# EasyEDA Pro project usbc_hub.epro

# Schematic Schematic1
Board Name: Board1; Create Date: 2025-07-18; Page Name: P1; Project Name: usbchub; Schematic Name: Schematic1; Update Date: 2025-07-29; Company: EasyEDA.com; Page Size: A4; Version: V1.0
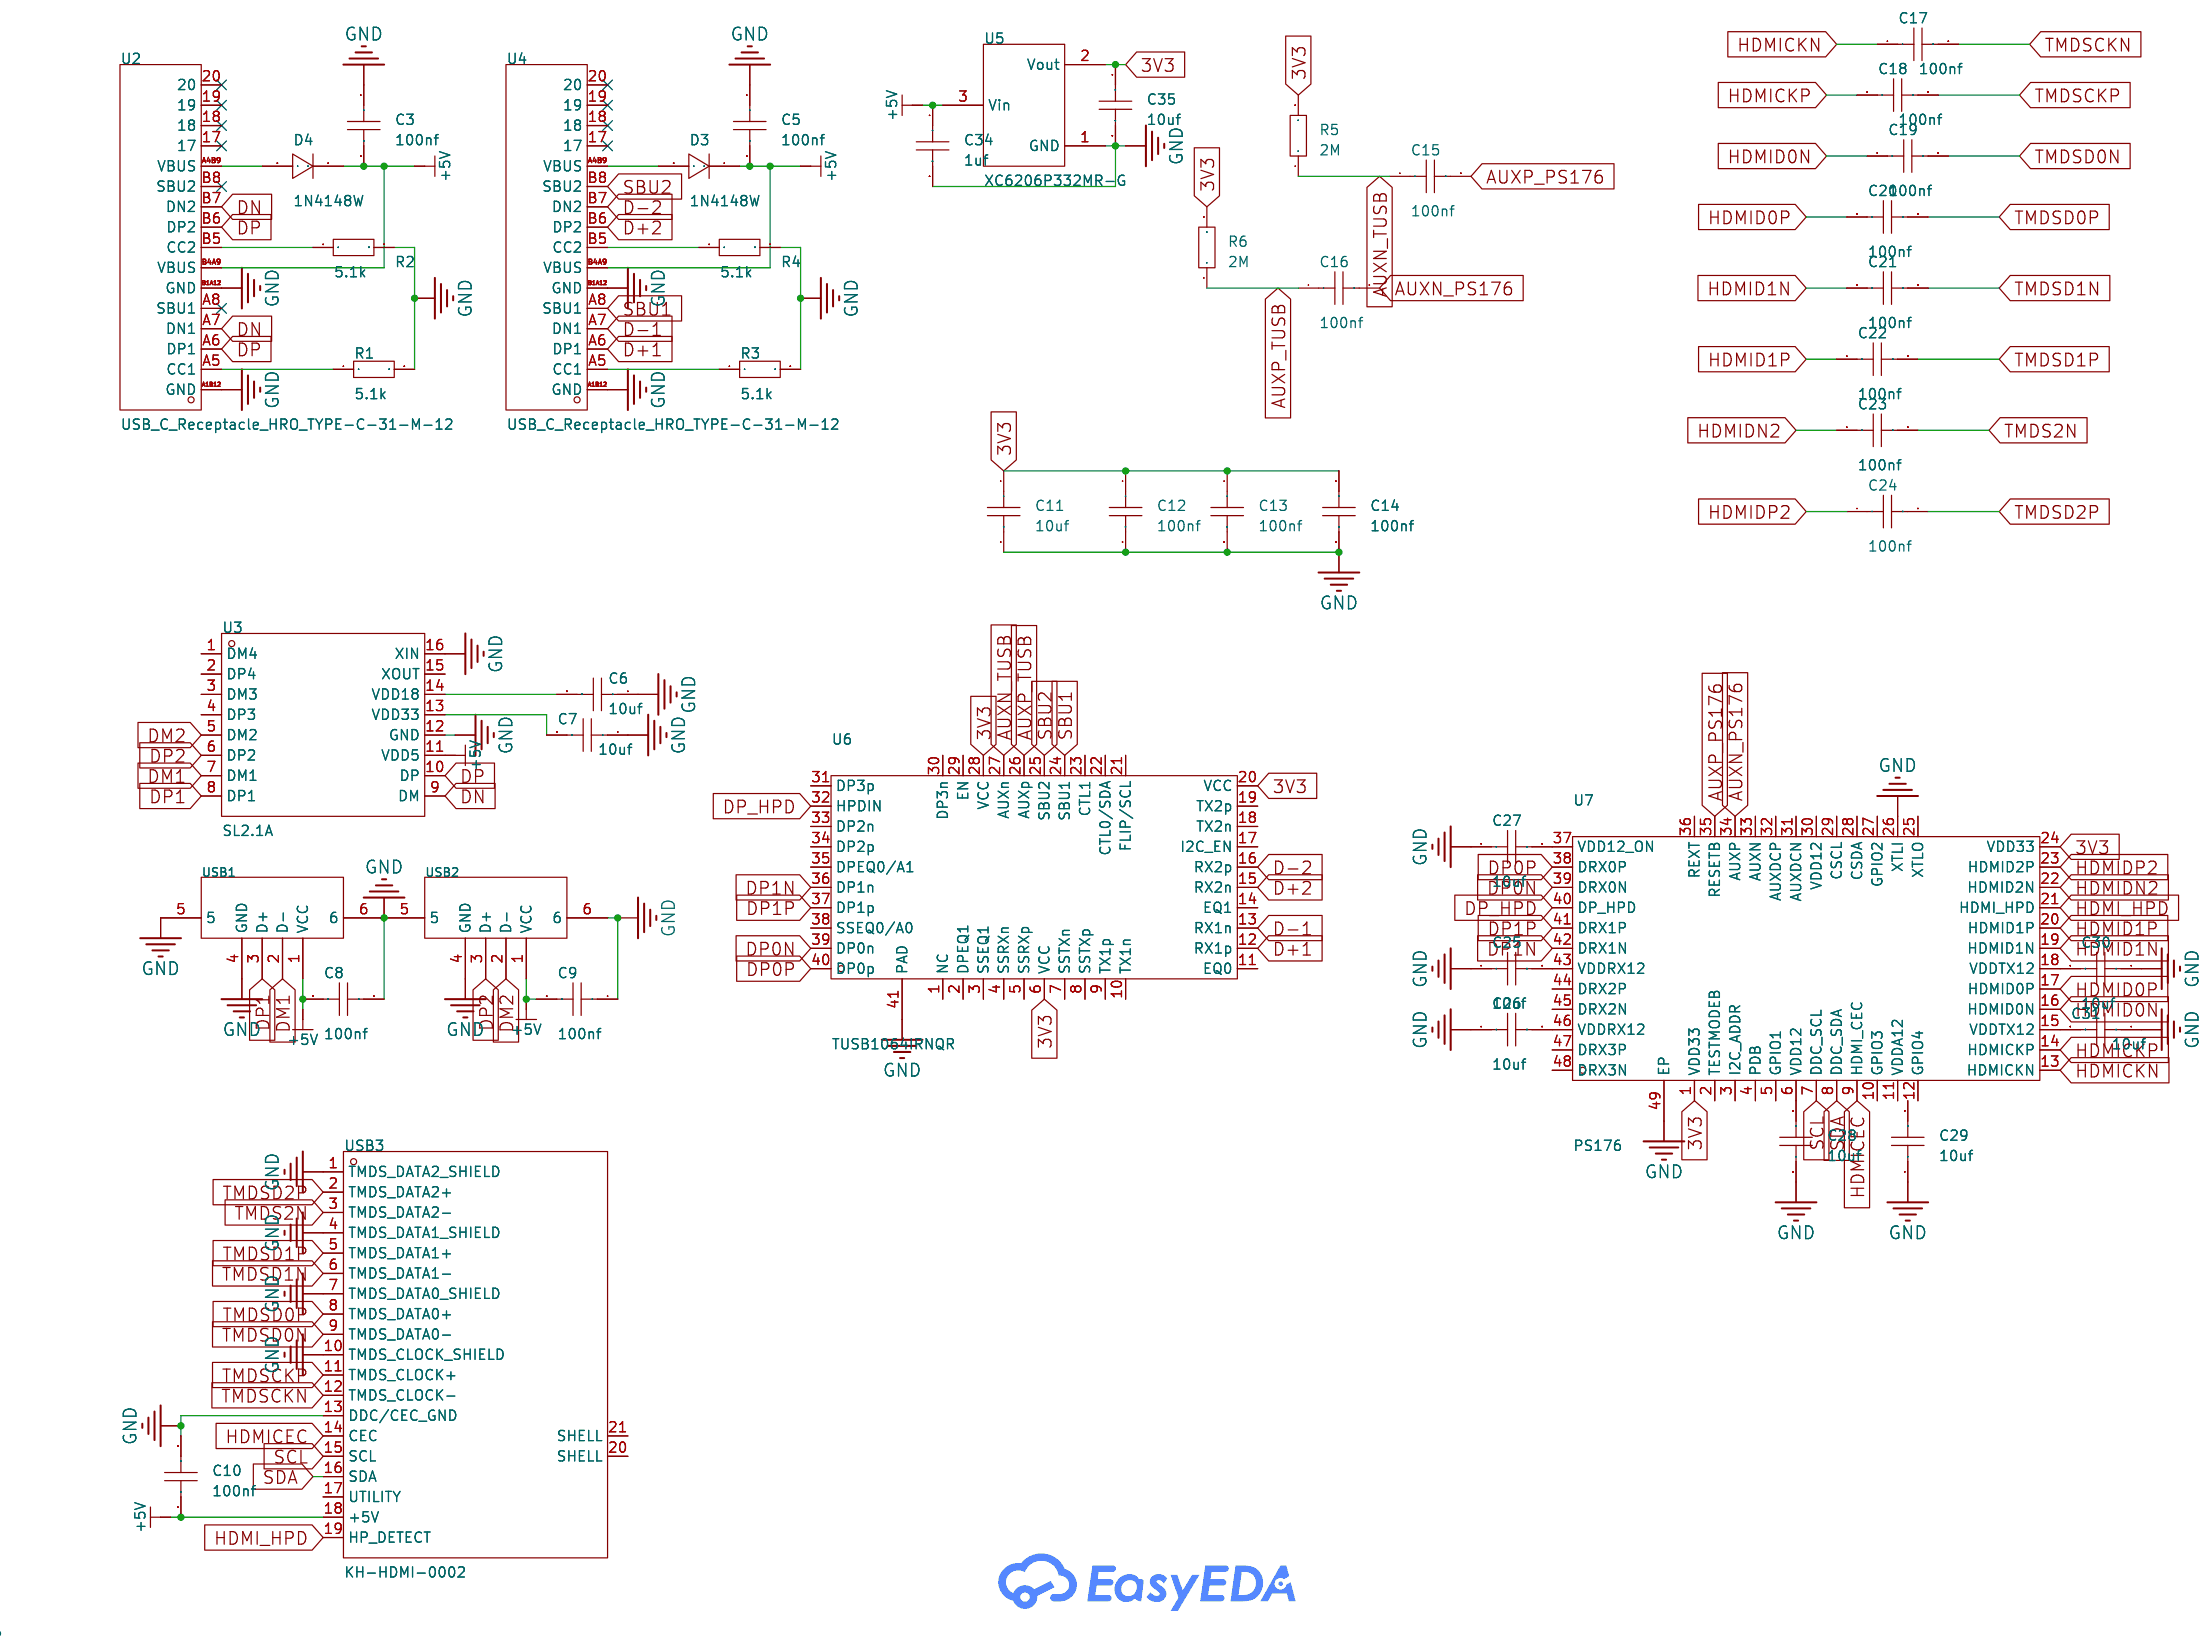
[diagram p0: schematic sheet]

## Parts
C3  100nf  [C0603]
C5  100nf  [C0603]
C6  10uf  [C0603]
C7  10uf  [C0603]
C8  100nf  [C0603]
C9  100nf  [C0603]
C10  100nf  [C0603]
C11  10uf  [C0603]
C12  100nf  [C0603]
C13  100nf  [C0603]
C14  100nf  [C0603]
C15  100nf  [C0603]
C16  100nf  [C0603]
C17  100nf  [C0603]
C18  100nf  [C0603]
C19  100nf  [C0603]
C20  100nf  [C0603]
C21  100nf  [C0603]
C22  100nf  [C0603]
C23  100nf  [C0603]
C24  100nf  [C0603]
C25  10uf  [C0603]
C26  10uf  [C0603]
C27  10uf  [C0603]
C28  10uf  [C0603]
C29  10uf  [C0603]
C30  10uf  [C0603]
C31  10uf  [C0603]
C34  1uf  [C0603]
C35  10uf  [C0603]
D3  1N4148W  [SOD-123F_L2.7-W1.6-LS3.8-RD]
D4  1N4148W  [SOD-123F_L2.7-W1.6-LS3.8-RD]
R1  5.1k  [R0603]
R2  5.1k  [R0603]
R3  5.1k  [R0603]
R4  5.1k  [R0603]
R5  2M  [R0603]
R6  2M  [R0603]
U2  USB_C_Receptacle_HRO_TYPE-C-31-M-12  [USB-SMD_TYPE-C16PIN-1]
U3  SL2.1A  [SOP-16_L10.0-W3.9-P1.27-LS6.0-BL]
U4  USB_C_Receptacle_HRO_TYPE-C-31-M-12  [USB-SMD_TYPE-C16PIN-1]
U5  XC6206P332MR-G  [SOT-23-3_L2.9-W1.6-P1.90-LS2.8-BR]
U6  TUSB1064IRNQR  [WQFN-40_L6.0-W4.0-P0.40-TL-EP4.7]
U7  PS176  [QFN-48_L6.0-W6.0-P0.40-TL-EP3.8]
USB1  903-131A1011D10100  [USB-A-TH_C46407]
USB2  903-131A1011D10100  [USB-A-TH_C46407]
USB3  KH-HDMI-0002  [HDMI-SMD_KH-HDMI-0002]

## Library data of the parts
C3 C5-C31 C34 C35 = CAP_0603: Supplier Footprint: 0603
D3 D4 = 1N4148W_C81598: Diode Configuration:Independent Type Forward Voltage (Vf@If):1V@50mA Reverse Voltage (Vr): Rectified Current: Reverse Leakage Current (Ir):1uA@75V Reverse Recovery Time (trr): Operating Temperature:- Operating Temperature:-; Supplier Part: C81598; Manufacturer: ST(先科); Supplier Footprint: SOD-123; Datasheet: https://atta.szlcsc.com/upload/public/pdf/source/20161024/1477288446905.pdf; Supplier: LCSC; Diode Configuration: Independent Type; Forward Voltage (Vf@If): 1V@50mA; Reverse Leakage Current (Ir): 1uA@75V
R1-R6 = Res_0603: Supplier Footprint: 0603
U2 U4 = USB_C_Receptacle_HRO_TYPE-C-31-M-12: Supplier Part: C9900015525; Supplier Footprint: USB_C_Receptacle_USB2.0; JLCPCB Part Class: Extended Part; Supplier: LCSC
U3 = SL2.1A: LCSC Part Name: USB2.0高速4端口HUB控制器; Supplier Part: C192893; Manufacturer: CoreChips(和芯润德); Supplier Footprint: SOP-16; JLCPCB Part Class: Extended Part; Datasheet: https://atta.szlcsc.com/upload/public/pdf/source/20180522/C192893_624110D24898D57AAC785E3DF98EA862.pdf; Supplier: LCSC
U5 = XC6206P332MR-G_C5446: Output Type: Maximum Input Voltage:6V Output Voltage:3.3V Output Voltage:3.3V MAX Output Current:200mA Power Supply Rejection Ratio (PSRR):- Dropout Voltage:680mV@(100mA) Output Polarity:Positive electrode Number of Outputs:1; LCSC Part Name: 输入6V 输出3.3V 200mA; Supplier Part: C5446; Manufacturer: TOREX(特瑞仕); Supplier Footprint: SOT-23-3L; JLCPCB Part Class: Basic Part; Datasheet: https://atta.szlcsc.com/upload/public/pdf/source/20130823/1457706639850.pdf; Supplier: LCSC; Maximum Input Voltage: 6V; Output Voltage: 3.3V; MAX Output Current: 200mA; Dropout Voltage: 680mV@(100mA); Output Polarity: Positive electrode; Number of Outputs: 1
U6 = TUSB1064IRNQR: Applications Function: Protocol:；DP 1.4 Number of Channels:4 Supply Voltage:3.3V Supply Voltage:3.3V Data Rate:10Gbps Operating Temperature:-40℃~+85℃ Operating Temperature:-40℃~+85℃; LCSC Part Name: TUSB1064 USB TYPE-C MDP交替模式10Gbps灌电流侧线性转接驱动器交叉点开关; Supplier Part: C2675165; Manufacturer: TI(德州仪器); Supplier Footprint: WQFN-40-EP(4x6); JLCPCB Part Class: Extended Part; Datasheet: https://www.ti.com/cn/lit/gpn/tusb1064; Supplier: LCSC; Protocol: ；DP 1.4; Number of Channels: 4; Supply Voltage: 3.3V; Data Rate: 10Gbps; Operating Temperature: -40℃~+85℃
U7 = PS176: Supplier Part: C209703; Manufacturer: parade(谱瑞科技); Supplier Footprint: QFN-48-EP(6x6); JLCPCB Part Class: Extended Part; Datasheet: https://atta.szlcsc.com/upload/public/pdf/source/20180530/C209703_54E1970A5C7B334E54DE40137D09E033.pdf; Supplier: LCSC
USB1 USB2 = 903-131A1011D10100: Connector Type:Type-A Standard:USB 2.0 Gender:Female Number of Ports:1 Number of Contacts:4P Current Rating - Power (Max):1.5A; LCSC Part Name: Type-A 母; Supplier Part: C46407; Manufacturer: 精拓金; Supplier Footprint: 插件; JLCPCB Part Class: Extended Part; Datasheet: https://atta.szlcsc.com/upload/public/pdf/source/20210301/C46407_0FDCFD777E72B2503A3E09AE32E4643C.pdf; Supplier: LCSC; Connector Type: Type-A; Standard: USB 2.0; Gender: Female; Number of Ports: 1; Number of Contacts: 4P; Current Rating - Power (Max): 1.5A
USB3 = KH-HDMI-0002: Connector Type:HDMI-C Gender:Mother Number of Pins:19P Mounting Style:Horizontal attachment Current Rating (Max):0.5A Rated Voltage (Max):40V Operating Temperature Range:-20℃~+85℃ Operating Temperature Range:-20℃~+85℃; Supplier Part: C5204136; Manufacturer: kinghelm(金航标); Supplier Footprint: SMD; JLCPCB Part Class: Extended Part; Datasheet: https://atta.szlcsc.com/upload/public/pdf/source/20221019/BF777A9BB0418986271236976E6968F4.pdf; Supplier: LCSC; Connector Type: HDMI-C; Gender: Mother; Number of Pins: 19P; Mounting Style: Horizontal attachment; Current Rating (Max): 0.5A; Rated Voltage (Max): 40V; Operating Temperature Range: -20℃~+85℃

## Nets
3V3: C11.1 C12.1 C13.1 C14.1 C35.1 R5.2 R6.2 U5.2(Vout) U6.6(VCC) U6.20(VCC) U6.28(VCC) U7.1(VDD33) U7.24(VDD33)
+5V: C3.2 C5.2 C8.2 C9.2 C10.1 C34.1 D3.1(K) D4.1(K) U2.B4A9(VBUS) U3.11(VDD5) U4.B4A9(VBUS) U5.3(Vin) USB1.1(VCC) USB2.1(VCC) USB3.18(+5V)
GND: C3.1 C5.1 C6.1 C7.1 C8.1 C9.1 C10.2 C11.2 C12.2 C13.2 C14.2 C25.1 C26.1 C27.1 C28.1 C29.1 C30.1 C31.1 C34.2 C35.2 R1.2 R2.2 R3.2 R4.2 U2.A1B12(GND) U2.B1A12(GND) U3.12(GND) U3.16(XIN) U4.A1B12(GND) U4.B1A12(GND) U5.1(GND) U6.41(PAD) U7.26(XTLI) U7.49(EP) USB1.4(GND) USB1.5 USB1.6 USB2.4(GND) USB2.5 USB2.6 USB3.1(TMDS_DATA2_SHIELD) USB3.4(TMDS_DATA1_SHIELD) USB3.7(TMDS_DATA0_SHIELD) USB3.10(TMDS_CLOCK_SHIELD) USB3.13(DDC/CEC_GND)
AUXN_PS176: C16.2 U7.34(AUXP)
AUXN_TUSB: C15.1 R5.1 U6.27(AUXn)
AUXP_PS176: C15.2 U7.35(RESETB)
AUXP_TUSB: C16.1 R6.1 U6.26(AUXp)
D+1: U4.A6(DP1) U6.12(RX1p)
D+2: U4.B6(DP2) U6.15(RX2n)
D-1: U4.A7(DN1) U6.13(RX1n)
D-2: U4.B7(DN2) U6.16(RX2p)
DM1: U3.7(DM1) USB1.2(D-)
DM2: U3.5(DM2) USB2.2(D-)
DN: U2.A7(DN1) U2.B7(DN2) U3.9(DM)
DP: U2.A6(DP1) U2.B6(DP2) U3.10(DP)
DP0N: U6.39(DP0n) U7.39(DRX0N)
DP0P: U6.40(DP0p) U7.38(DRX0P)
DP1: U3.8(DP1) USB1.3(D+)
DP1N: U6.36(DP1n) U7.42(DRX1N)
DP1P: U6.37(DP1p) U7.41(DRX1P)
DP2: U3.6(DP2) USB2.3(D+)
DP_HPD: U6.32(HPDIN) U7.40(DP_HPD)
HDMI_HPD: U7.21(HDMI_HPD) USB3.19(HP_DETECT)
HDMICEC: U7.9(HDMI_CEC) USB3.14(CEC)
HDMICKN: C17.1 U7.13(HDMICKN)
HDMICKP: C18.1 U7.14(HDMICKP)
HDMID0N: C19.1 U7.16(HDMID0N)
HDMID0P: C20.1 U7.17(HDMID0P)
HDMID1N: C21.1 U7.19(HDMID1N)
HDMID1P: C22.1 U7.20(HDMID1P)
HDMIDN2: C23.1 U7.22(HDMID2N)
HDMIDP2: C24.1 U7.23(HDMID2P)
SBU1: U4.A8(SBU1) U6.24(SBU1)
SBU2: U4.B8(SBU2) U6.25(SBU2)
SCL: U7.7(DDC_SCL) USB3.15(SCL)
SDA: U7.8(DDC_SDA) USB3.16(SDA)
TMDS2N: C23.2 USB3.3(TMDS_DATA2-)
TMDSCKN: C17.2 USB3.12(TMDS_CLOCK-)
TMDSCKP: C18.2 USB3.11(TMDS_CLOCK+)
TMDSD0N: C19.2 USB3.9(TMDS_DATA0-)
TMDSD0P: C20.2 USB3.8(TMDS_DATA0+)
TMDSD1N: C21.2 USB3.6(TMDS_DATA1-)
TMDSD1P: C22.2 USB3.5(TMDS_DATA1+)
TMDSD2P: C24.2 USB3.2(TMDS_DATA2+)
$1N8798: R1.1 U2.A5(CC1)
$1N8800: R2.1 U2.B5(CC2)
$1N8818: R3.1 U4.A5(CC1)
$1N8820: R4.1 U4.B5(CC2)
$1N8833: C6.2 U3.14(VDD18)
$1N8835: C7.2 U3.13(VDD33)
$1N8904: D4.2(A) U2.A4B9(VBUS)
$1N8906: D3.2(A) U4.A4B9(VBUS)
$1N8932: C25.2 U7.43(VDDRX12)
$1N8935: C26.2 U7.46(VDDRX12)
$1N8936: C27.2 U7.37(VDD12_ON)
$1N8938: C28.2 U7.6(VDD12)
$1N8941: C30.2 U7.18(VDDTX12)
$1N8943: C31.2 U7.15(VDDTX12)

Not connected (* = marked no-connect by the designer): C29 2; U2 17* 18* 19* 20* A8(SBU1)* B8(SBU2)*; U3 1(DM4) 2(DP4) 3(DM3) 4(DP3) 15(XOUT); U4 17* 18* 19* 20*; U6 1(NC) 2(DPEQ1) 3(SSEQ1) 4(SSRXn) 5(SSRXp) 7(SSTXn) 8(SSTXp) 9(TX1p) 10(TX1n) 11(EQ0) 14(EQ1) 17(I2C_EN) 18(TX2n) 19(TX2p) 21(FLIP/SCL) 22(CTL0/SDA) 23(CTL1) 29(EN) 30(DP3n) 31(DP3p) 33(DP2n) 34(DP2p) 35(DPEQ0/A1) 38(SSEQ0/A0); U7 2(TESTMODEB) 3(I2C_ADDR) 4(PDB) 5(GPIO1) 10(GPIO3) 11(VDDA12) 12(GPIO4) 25(XTLO) 27(GPIO2) 28(CSDA) 29(CSCL) 30(VDD12) 31(AUXDCN) 32(AUXDCP) 33(AUXN) 36(REXT) 44(DRX2P) 45(DRX2N) 47(DRX3P) 48(DRX3N); USB3 17(UTILITY) 20(SHELL) 21(SHELL)

# Schematic Schematic2
Board Name: PCB2; Create Date: 2025-07-27; Page Name: P1; Project Name: usbchub; Schematic Name: Schematic2; Update Date: 2025-07-29; Company: EasyEDA.com; Page Size: A4; Version: V1.0
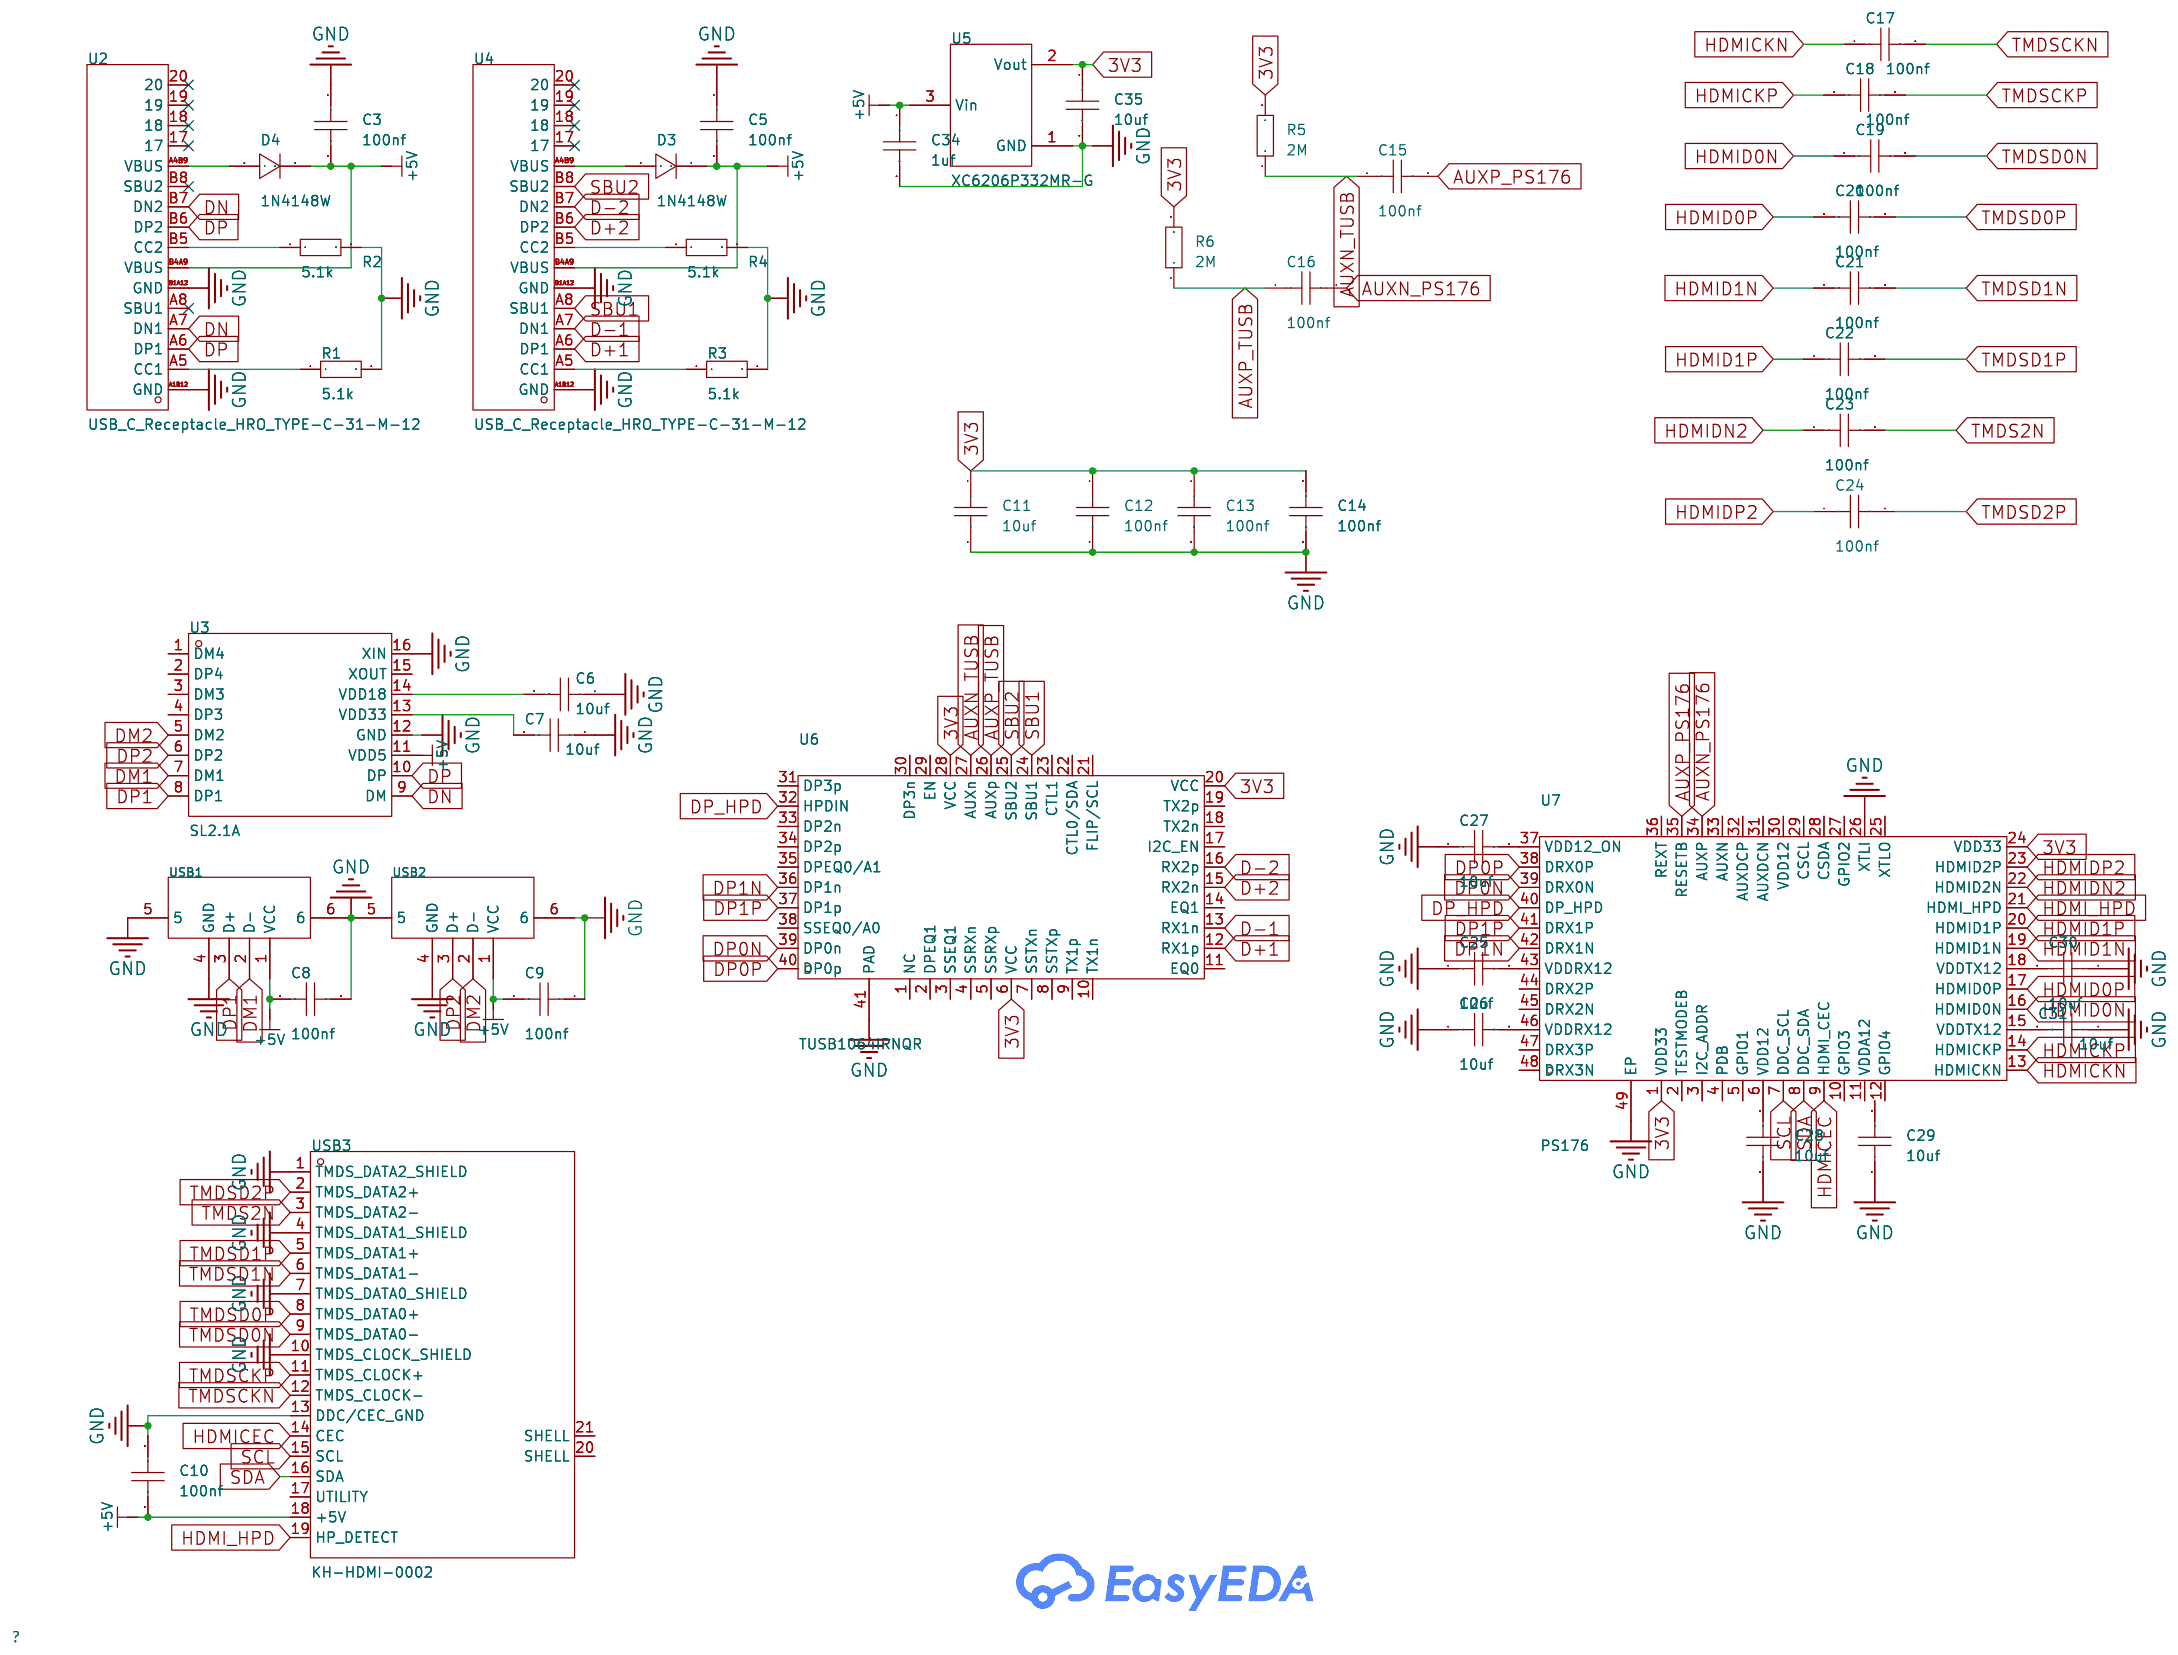
[diagram p1: schematic sheet]

## Parts
C3  100nf  [C0603]
C5  100nf  [C0603]
C6  10uf  [C0603]
C7  10uf  [C0603]
C8  100nf  [C0603]
C9  100nf  [C0603]
C10  100nf  [C0603]
C11  10uf  [C0603]
C12  100nf  [C0603]
C13  100nf  [C0603]
C14  100nf  [C0603]
C15  100nf  [C0603]
C16  100nf  [C0603]
C17  100nf  [C0603]
C18  100nf  [C0603]
C19  100nf  [C0603]
C20  100nf  [C0603]
C21  100nf  [C0603]
C22  100nf  [C0603]
C23  100nf  [C0603]
C24  100nf  [C0603]
C25  10uf  [C0603]
C26  10uf  [C0603]
C27  10uf  [C0603]
C28  10uf  [C0603]
C29  10uf  [C0603]
C30  10uf  [C0603]
C31  10uf  [C0603]
C34  1uf  [C0603]
C35  10uf  [C0603]
D3  1N4148W  [SOD-123F_L2.7-W1.6-LS3.8-RD]
D4  1N4148W  [SOD-123F_L2.7-W1.6-LS3.8-RD]
R1  5.1k  [R0603]
R2  5.1k  [R0603]
R3  5.1k  [R0603]
R4  5.1k  [R0603]
R5  2M  [R0603]
R6  2M  [R0603]
U2  USB_C_Receptacle_HRO_TYPE-C-31-M-12  [USB-SMD_TYPE-C16PIN-1]
U3  SL2.1A  [SOP-16_L10.0-W3.9-P1.27-LS6.0-BL]
U4  USB_C_Receptacle_HRO_TYPE-C-31-M-12  [USB-SMD_TYPE-C16PIN-1]
U5  XC6206P332MR-G  [SOT-23-3_L2.9-W1.6-P1.90-LS2.8-BR]
U6  TUSB1064IRNQR  [WQFN-40_L6.0-W4.0-P0.40-TL-EP4.7]
U7  PS176  [QFN-48_L6.0-W6.0-P0.40-TL-EP3.8]
USB1  903-131A1011D10100  [USB-A-TH_C46407]
USB2  903-131A1011D10100  [USB-A-TH_C46407]
USB3  KH-HDMI-0002  [HDMI-SMD_KH-HDMI-0002]

## Library data of the parts
C3 C5-C31 C34 C35 = CAP_0603: Supplier Footprint: 0603
D3 D4 = 1N4148W_C81598: Diode Configuration:Independent Type Forward Voltage (Vf@If):1V@50mA Reverse Voltage (Vr): Rectified Current: Reverse Leakage Current (Ir):1uA@75V Reverse Recovery Time (trr): Operating Temperature:- Operating Temperature:-; Supplier Part: C81598; Manufacturer: ST(先科); Supplier Footprint: SOD-123; Datasheet: https://atta.szlcsc.com/upload/public/pdf/source/20161024/1477288446905.pdf; Supplier: LCSC; Diode Configuration: Independent Type; Forward Voltage (Vf@If): 1V@50mA; Reverse Leakage Current (Ir): 1uA@75V
R1-R6 = Res_0603: Supplier Footprint: 0603
U2 U4 = USB_C_Receptacle_HRO_TYPE-C-31-M-12: Supplier Part: C9900015525; Supplier Footprint: USB_C_Receptacle_USB2.0; JLCPCB Part Class: Extended Part; Supplier: LCSC
U3 = SL2.1A: LCSC Part Name: USB2.0高速4端口HUB控制器; Supplier Part: C192893; Manufacturer: CoreChips(和芯润德); Supplier Footprint: SOP-16; JLCPCB Part Class: Extended Part; Datasheet: https://atta.szlcsc.com/upload/public/pdf/source/20180522/C192893_624110D24898D57AAC785E3DF98EA862.pdf; Supplier: LCSC
U5 = XC6206P332MR-G_C5446: Output Type: Maximum Input Voltage:6V Output Voltage:3.3V Output Voltage:3.3V MAX Output Current:200mA Power Supply Rejection Ratio (PSRR):- Dropout Voltage:680mV@(100mA) Output Polarity:Positive electrode Number of Outputs:1; LCSC Part Name: 输入6V 输出3.3V 200mA; Supplier Part: C5446; Manufacturer: TOREX(特瑞仕); Supplier Footprint: SOT-23-3L; JLCPCB Part Class: Basic Part; Datasheet: https://atta.szlcsc.com/upload/public/pdf/source/20130823/1457706639850.pdf; Supplier: LCSC; Maximum Input Voltage: 6V; Output Voltage: 3.3V; MAX Output Current: 200mA; Dropout Voltage: 680mV@(100mA); Output Polarity: Positive electrode; Number of Outputs: 1
U6 = TUSB1064IRNQR: Applications Function: Protocol:；DP 1.4 Number of Channels:4 Supply Voltage:3.3V Supply Voltage:3.3V Data Rate:10Gbps Operating Temperature:-40℃~+85℃ Operating Temperature:-40℃~+85℃; LCSC Part Name: TUSB1064 USB TYPE-C MDP交替模式10Gbps灌电流侧线性转接驱动器交叉点开关; Supplier Part: C2675165; Manufacturer: TI(德州仪器); Supplier Footprint: WQFN-40-EP(4x6); JLCPCB Part Class: Extended Part; Datasheet: https://www.ti.com/cn/lit/gpn/tusb1064; Supplier: LCSC; Protocol: ；DP 1.4; Number of Channels: 4; Supply Voltage: 3.3V; Data Rate: 10Gbps; Operating Temperature: -40℃~+85℃
U7 = PS176: Supplier Part: C209703; Manufacturer: parade(谱瑞科技); Supplier Footprint: QFN-48-EP(6x6); JLCPCB Part Class: Extended Part; Datasheet: https://atta.szlcsc.com/upload/public/pdf/source/20180530/C209703_54E1970A5C7B334E54DE40137D09E033.pdf; Supplier: LCSC
USB1 USB2 = 903-131A1011D10100: Connector Type:Type-A Standard:USB 2.0 Gender:Female Number of Ports:1 Number of Contacts:4P Current Rating - Power (Max):1.5A; LCSC Part Name: Type-A 母; Supplier Part: C46407; Manufacturer: 精拓金; Supplier Footprint: 插件; JLCPCB Part Class: Extended Part; Datasheet: https://atta.szlcsc.com/upload/public/pdf/source/20210301/C46407_0FDCFD777E72B2503A3E09AE32E4643C.pdf; Supplier: LCSC; Connector Type: Type-A; Standard: USB 2.0; Gender: Female; Number of Ports: 1; Number of Contacts: 4P; Current Rating - Power (Max): 1.5A
USB3 = KH-HDMI-0002: Connector Type:HDMI-C Gender:Mother Number of Pins:19P Mounting Style:Horizontal attachment Current Rating (Max):0.5A Rated Voltage (Max):40V Operating Temperature Range:-20℃~+85℃ Operating Temperature Range:-20℃~+85℃; Supplier Part: C5204136; Manufacturer: kinghelm(金航标); Supplier Footprint: SMD; JLCPCB Part Class: Extended Part; Datasheet: https://atta.szlcsc.com/upload/public/pdf/source/20221019/BF777A9BB0418986271236976E6968F4.pdf; Supplier: LCSC; Connector Type: HDMI-C; Gender: Mother; Number of Pins: 19P; Mounting Style: Horizontal attachment; Current Rating (Max): 0.5A; Rated Voltage (Max): 40V; Operating Temperature Range: -20℃~+85℃

## Nets
3V3: C11.1 C12.1 C13.1 C14.1 C35.1 R5.2 R6.2 U5.2(Vout) U6.6(VCC) U6.20(VCC) U6.28(VCC) U7.1(VDD33) U7.24(VDD33)
+5V: C3.2 C5.2 C8.2 C9.2 C10.1 C34.1 D3.1(K) D4.1(K) U2.B4A9(VBUS) U3.11(VDD5) U4.B4A9(VBUS) U5.3(Vin) USB1.1(VCC) USB2.1(VCC) USB3.18(+5V)
GND: C3.1 C5.1 C6.1 C7.1 C8.1 C9.1 C10.2 C11.2 C12.2 C13.2 C14.2 C25.1 C26.1 C27.1 C28.1 C29.1 C30.1 C31.1 C34.2 C35.2 R1.2 R2.2 R3.2 R4.2 U2.A1B12(GND) U2.B1A12(GND) U3.12(GND) U3.16(XIN) U4.A1B12(GND) U4.B1A12(GND) U5.1(GND) U6.41(PAD) U7.26(XTLI) U7.49(EP) USB1.4(GND) USB1.5 USB1.6 USB2.4(GND) USB2.5 USB2.6 USB3.1(TMDS_DATA2_SHIELD) USB3.4(TMDS_DATA1_SHIELD) USB3.7(TMDS_DATA0_SHIELD) USB3.10(TMDS_CLOCK_SHIELD) USB3.13(DDC/CEC_GND)
AUXN_PS176: C16.2 U7.34(AUXP)
AUXN_TUSB: C15.1 R5.1 U6.27(AUXn)
AUXP_PS176: C15.2 U7.35(RESETB)
AUXP_TUSB: C16.1 R6.1 U6.26(AUXp)
D+1: U4.A6(DP1) U6.12(RX1p)
D+2: U4.B6(DP2) U6.15(RX2n)
D-1: U4.A7(DN1) U6.13(RX1n)
D-2: U4.B7(DN2) U6.16(RX2p)
DM1: U3.7(DM1) USB1.2(D-)
DM2: U3.5(DM2) USB2.2(D-)
DN: U2.A7(DN1) U2.B7(DN2) U3.9(DM)
DP: U2.A6(DP1) U2.B6(DP2) U3.10(DP)
DP0N: U6.39(DP0n) U7.39(DRX0N)
DP0P: U6.40(DP0p) U7.38(DRX0P)
DP1: U3.8(DP1) USB1.3(D+)
DP1N: U6.36(DP1n) U7.42(DRX1N)
DP1P: U6.37(DP1p) U7.41(DRX1P)
DP2: U3.6(DP2) USB2.3(D+)
DP_HPD: U6.32(HPDIN) U7.40(DP_HPD)
HDMI_HPD: U7.21(HDMI_HPD) USB3.19(HP_DETECT)
HDMICEC: U7.9(HDMI_CEC) USB3.14(CEC)
HDMICKN: C17.1 U7.13(HDMICKN)
HDMICKP: C18.1 U7.14(HDMICKP)
HDMID0N: C19.1 U7.16(HDMID0N)
HDMID0P: C20.1 U7.17(HDMID0P)
HDMID1N: C21.1 U7.19(HDMID1N)
HDMID1P: C22.1 U7.20(HDMID1P)
HDMIDN2: C23.1 U7.22(HDMID2N)
HDMIDP2: C24.1 U7.23(HDMID2P)
SBU1: U4.A8(SBU1) U6.24(SBU1)
SBU2: U4.B8(SBU2) U6.25(SBU2)
SCL: U7.7(DDC_SCL) USB3.15(SCL)
SDA: U7.8(DDC_SDA) USB3.16(SDA)
TMDS2N: C23.2 USB3.3(TMDS_DATA2-)
TMDSCKN: C17.2 USB3.12(TMDS_CLOCK-)
TMDSCKP: C18.2 USB3.11(TMDS_CLOCK+)
TMDSD0N: C19.2 USB3.9(TMDS_DATA0-)
TMDSD0P: C20.2 USB3.8(TMDS_DATA0+)
TMDSD1N: C21.2 USB3.6(TMDS_DATA1-)
TMDSD1P: C22.2 USB3.5(TMDS_DATA1+)
TMDSD2P: C24.2 USB3.2(TMDS_DATA2+)
$1N12287: R1.1 U2.A5(CC1)
$1N12289: R2.1 U2.B5(CC2)
$1N12299: R3.1 U4.A5(CC1)
$1N12301: R4.1 U4.B5(CC2)
$1N12314: C6.2 U3.14(VDD18)
$1N12316: C7.2 U3.13(VDD33)
$1N12385: D4.2(A) U2.A4B9(VBUS)
$1N12387: D3.2(A) U4.A4B9(VBUS)
$1N12413: C25.2 U7.43(VDDRX12)
$1N12416: C26.2 U7.46(VDDRX12)
$1N12417: C27.2 U7.37(VDD12_ON)
$1N12419: C28.2 U7.6(VDD12)
$1N12422: C30.2 U7.18(VDDTX12)
$1N12424: C31.2 U7.15(VDDTX12)

Not connected (* = marked no-connect by the designer): C29 2; U2 17* 18* 19* 20* A8(SBU1)* B8(SBU2)*; U3 1(DM4) 2(DP4) 3(DM3) 4(DP3) 15(XOUT); U4 17* 18* 19* 20*; U6 1(NC) 2(DPEQ1) 3(SSEQ1) 4(SSRXn) 5(SSRXp) 7(SSTXn) 8(SSTXp) 9(TX1p) 10(TX1n) 11(EQ0) 14(EQ1) 17(I2C_EN) 18(TX2n) 19(TX2p) 21(FLIP/SCL) 22(CTL0/SDA) 23(CTL1) 29(EN) 30(DP3n) 31(DP3p) 33(DP2n) 34(DP2p) 35(DPEQ0/A1) 38(SSEQ0/A0); U7 2(TESTMODEB) 3(I2C_ADDR) 4(PDB) 5(GPIO1) 10(GPIO3) 11(VDDA12) 12(GPIO4) 25(XTLO) 27(GPIO2) 28(CSDA) 29(CSCL) 30(VDD12) 31(AUXDCN) 32(AUXDCP) 33(AUXN) 36(REXT) 44(DRX2P) 45(DRX2N) 47(DRX3P) 48(DRX3N); USB3 17(UTILITY) 20(SHELL) 21(SHELL)

# Board PCB1
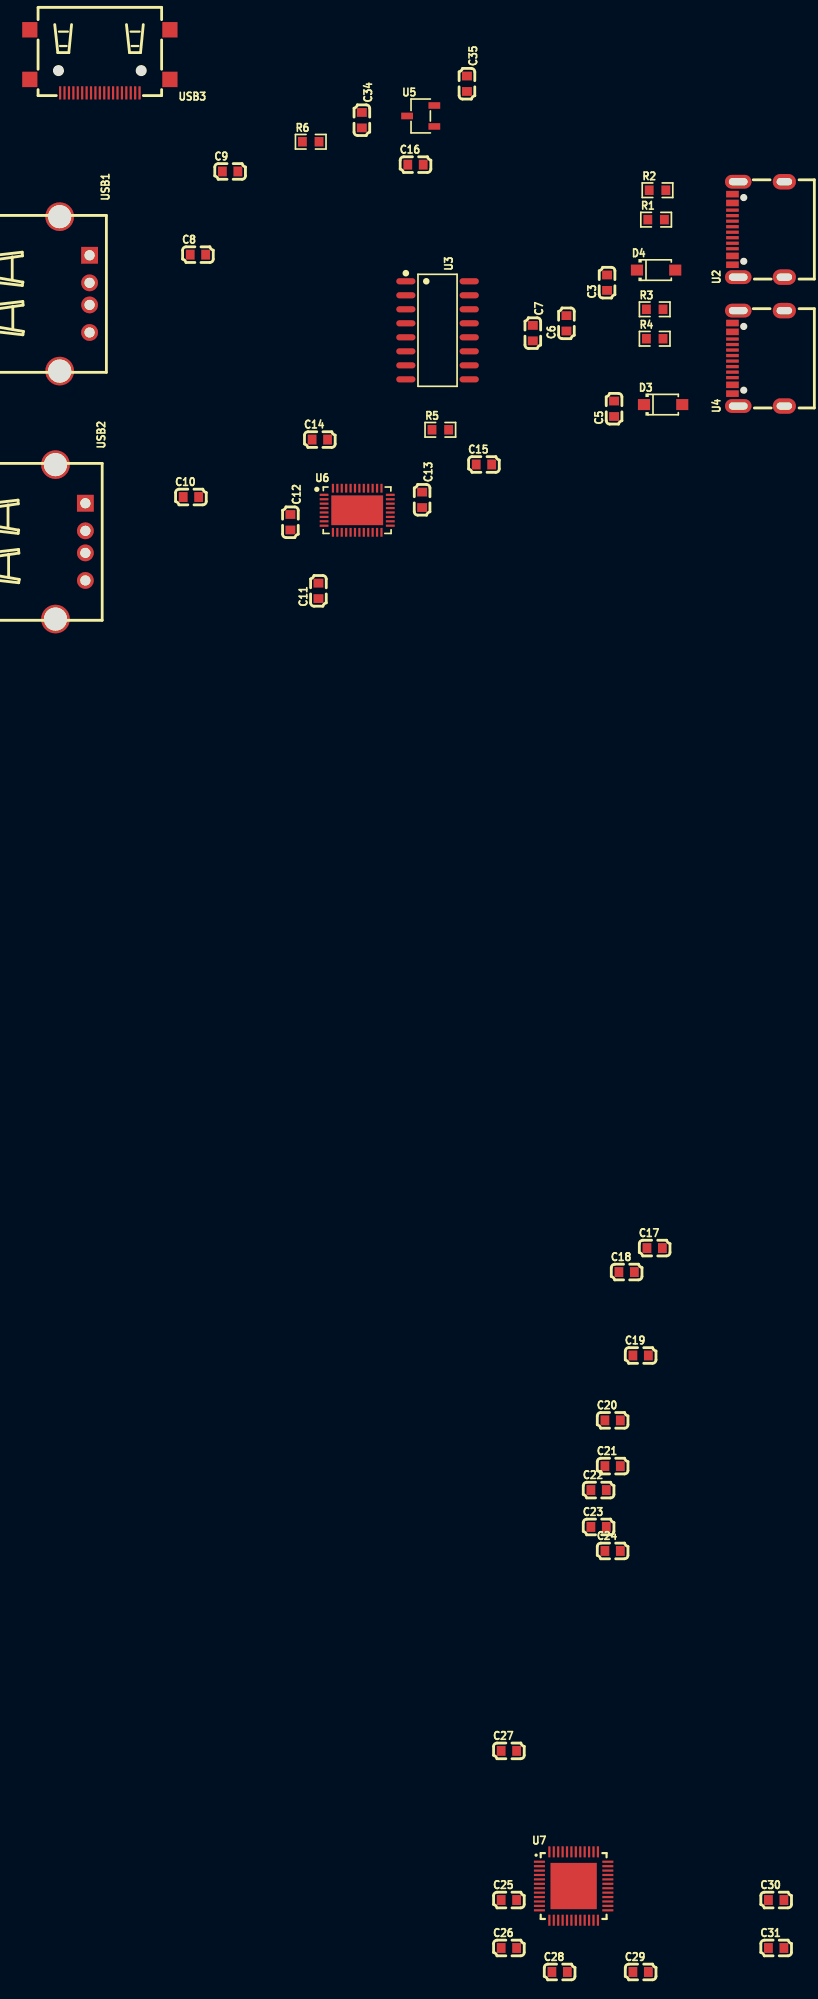
[diagram p2: board, top side]
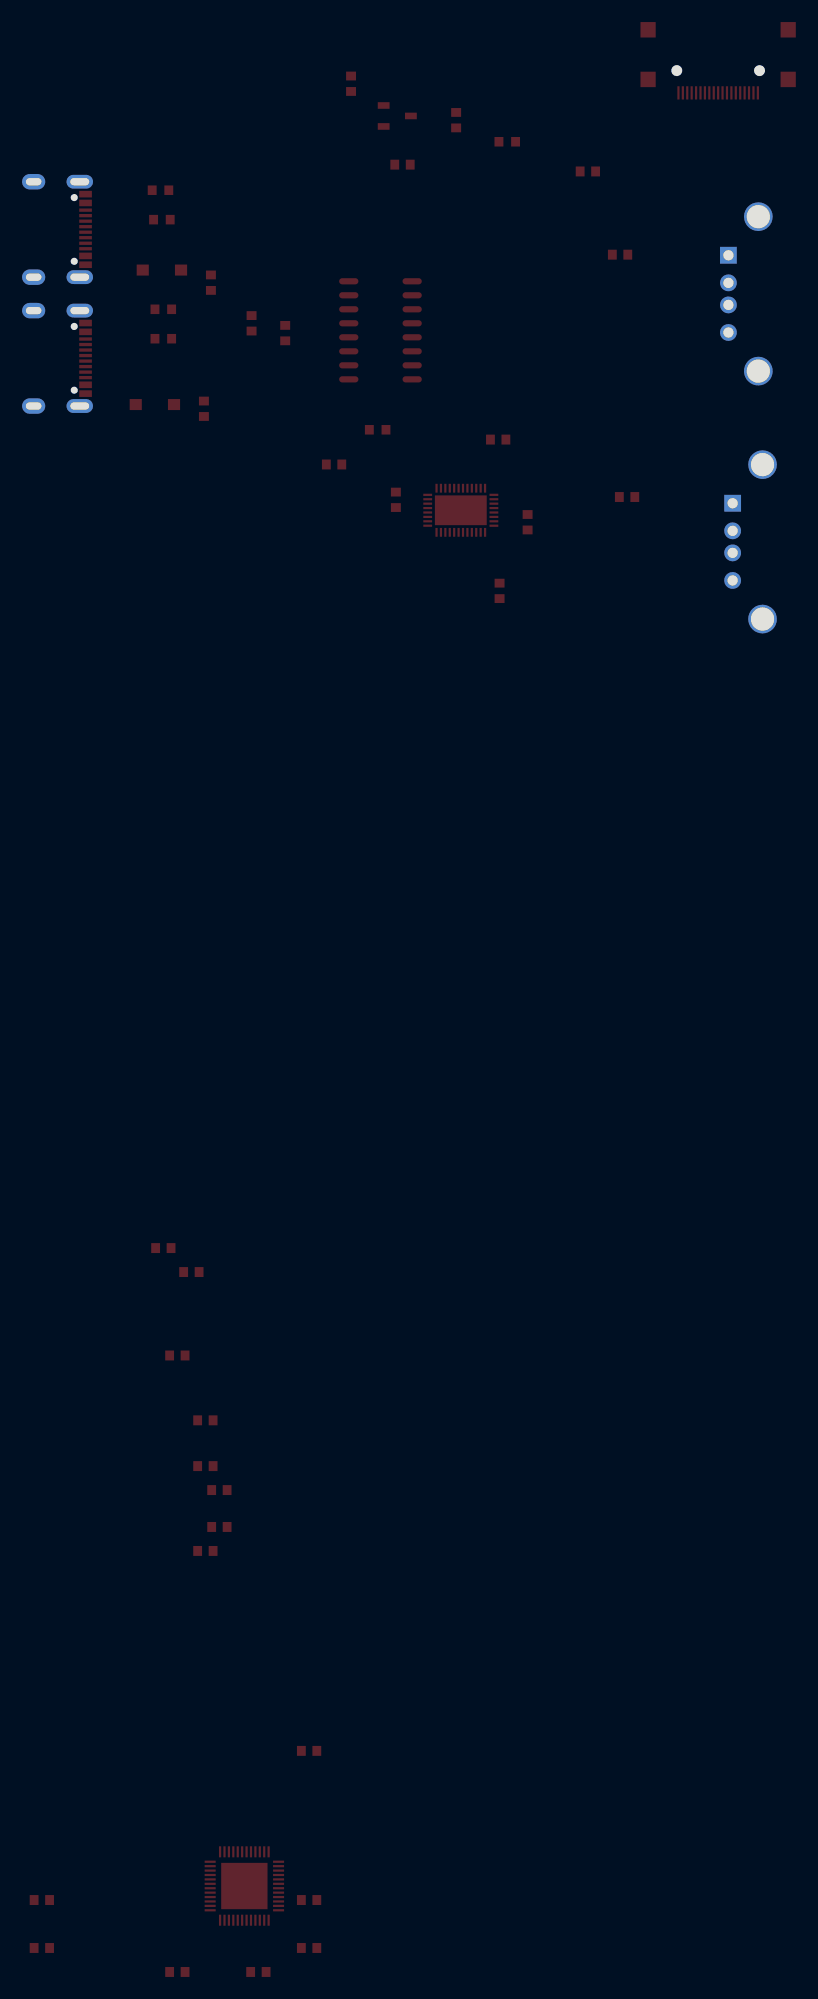
[diagram p3: board, bottom side, seen from below]

Outline 62.93 x 29.79 mm; copper layers: Top Layer, Bottom Layer. Coordinates in mm from the lower left corner of the outline.
Stack: Top Layer 0.035mm / Dielectric1 1.51mm FR4 er 4.5 / Bottom Layer 0.035mm

## Design rules (mm)
template: JLCPCB Capability(Two Layers Board)
spacing copperThickness1oz (default): track to track 0.102, other pairs 0.152 to 0.3
spacing copperThickness2oz: track to track 0.203, other pairs 0.152 to 0.3
track width copperThickness1oz (default): min 0.127, default 0.254, max 2.54
track width copperThickness2oz: min 0.203, default 0.254, max 2.54
differential pair differentialPair (default): width min 0.127, default 0.254, max 2.54; gap min 0.152, default 0.152
via viaSize (default): diameter min 0.5, default 0.61, max 10; hole min 0.3, default 0.305, max 6.3

## Placement (name value [footprint] x y rotation side)
C3  100nf  [C0603]  50.22 10.07 90 top
C5  100nf  [C0603]  50.85 -1.36 90 top
C6  10uf  [C0603]  46.54 6.39 90 top
C7  10uf  [C0603]  43.49 5.5 270 top
C8  100nf  [C0603]  13.14 12.61 0 top
C9  100nf  [C0603]  16.05 20.15 0 top
C10  100nf  [C0603]  12.5 -9.36 0 top
C11  10uf  [C0603]  24.06 -17.87 90 top
C12  100nf  [C0603]  21.52 -11.65 270 top
C13  100nf  [C0603]  33.46 -9.61 270 top
C14  100nf  [C0603]  24.18 -4.15 0 top
C15  100nf  [C0603]  39.06 -6.41 0 top
C16  100nf  [C0603]  32.86 20.77 0 top
C17  100nf  [C0603]  54.53 -77.45 0 top
C18  100nf  [C0603]  51.99 -79.62 0 top
C19  100nf  [C0603]  53.26 -87.18 0 top
C20  100nf  [C0603]  50.72 -93.06 0 top
C21  100nf  [C0603]  50.72 -97.21 0 top
C22  100nf  [C0603]  49.45 -99.39 0 top
C23  100nf  [C0603]  49.45 -102.73 0 top
C24  100nf  [C0603]  50.72 -104.9 0 top
C25  10uf  [C0603]  41.32 -136.55 0 top
C26  10uf  [C0603]  41.32 -140.9 0 top
C27  10uf  [C0603]  41.32 -123.03 0 top
C28  10uf  [C0603]  45.92 -143.07 0 top
C29  10uf  [C0603]  53.26 -143.07 0 top
C30  10uf  [C0603]  65.55 -136.55 0 top
C31  10uf  [C0603]  65.55 -140.9 0 top
C34  1uf  [C0603]  27.99 24.8 270 top
C35  10uf  [C0603]  37.52 28.1 270 top
D3  1N4148W  [SOD-123F_L2.7-W1.6-LS3.8-RD]  55.3 -0.98 0 top
D4  1N4148W  [SOD-123F_L2.7-W1.6-LS3.8-RD]  54.66 11.21 0 top
R1  5.1k  [R0603]  54.66 15.79 0 top
R2  5.1k  [R0603]  54.79 18.45 0 top
R3  5.1k  [R0603]  54.54 7.66 0 top
R4  5.1k  [R0603]  54.54 4.99 0 top
R5  2M  [R0603]  35.11 -3.26 0 top
R6  2M  [R0603]  23.36 22.85 0 top
U2  USB_C_Receptacle_HRO_TYPE-C-31-M-12  [USB-SMD_TYPE-C16PIN-1]  63.94 14.9 90 top
U3  SL2.1A  [SOP-16_L10.0-W3.9-P1.27-LS6.0-BL]  34.85 5.75 270 top
U4  USB_C_Receptacle_HRO_TYPE-C-31-M-12  [USB-SMD_TYPE-C16PIN-1]  63.94 3.21 90 top
U5  XC6206P332MR-G  [SOT-23-3_L2.9-W1.6-P1.90-LS2.8-BR]  33.33 25.18 0 top
U6  TUSB1064IRNQR  [WQFN-40_L6.0-W4.0-P0.40-TL-EP4.7]  27.57 -10.56 0 top
U7  PS176  [QFN-48_L6.0-W6.0-P0.40-TL-EP3.8]  47.19 -135.28 0 top
USB1  903-131A1011D10100  [USB-A-TH_C46407]  1.96 9.05 270 top
USB2  903-131A1011D10100  [USB-A-TH_C46407]  1.58 -13.42 270 top
USB3  KH-HDMI-0002  [HDMI-SMD_KH-HDMI-0002]  4.25 30.14 180 top

## Footprints (pads in the part's own frame, mm; a bottom-side part is the same pattern mirrored in y, then rotated)
C0603
  rect 0.8x0.9 smd: 1(-0.7,0) 2(0.7,0)
HDMI-SMD_KH-HDMI-0002
  rect 0.2x1.2 smd: 1(3.6,2.86) 2(3.2,2.86) 3(2.8,2.86) 4(2.4,2.86) 5(2,2.86) 6(1.6,2.86) 7(1.2,2.86) 8(0.8,2.86) 9(0.4,2.86) 10(0,2.86) 11(-0.4,2.86) 12(-0.8,2.86) 13(-1.2,2.86) 14(-1.6,2.86) 15(-2,2.86) 16(-2.4,2.86) 17(-2.8,2.86) 18(-3.2,2.86) 19(-3.6,2.86)
  rect 1.38x1.4 smd: 20(-6.35,1.64) 20(6.35,1.64) 21(-6.35,-2.86) 21(6.35,-2.86)
QFN-48_L6.0-W6.0-P0.40-TL-EP3.8
  rect 1x0.2 smd: 1(-3.1,2.2) 2(-3.1,1.8) 3(-3.1,1.4) 4(-3.1,1) 5(-3.1,0.6) 6(-3.1,0.2) 7(-3.1,-0.2) 8(-3.1,-0.6) 9(-3.1,-1) 10(-3.1,-1.4) 11(-3.1,-1.8) 12(-3.1,-2.2) 25(3.1,-2.2) 26(3.1,-1.8) 27(3.1,-1.4) 28(3.1,-1) 29(3.1,-0.6) 30(3.1,-0.2) 31(3.1,0.2) 32(3.1,0.6) 33(3.1,1) 34(3.1,1.4) 35(3.1,1.8) 36(3.1,2.2)
  rect 0.2x1 smd: 13(-2.2,-3.1) 14(-1.8,-3.1) 15(-1.4,-3.1) 16(-1,-3.1) 17(-0.6,-3.1) 18(-0.2,-3.1) 19(0.2,-3.1) 20(0.6,-3.1) 21(1,-3.1) 22(1.4,-3.1) 23(1.8,-3.1) 24(2.2,-3.1) 37(2.2,3.1) 38(1.8,3.1) 39(1.4,3.1) 40(1,3.1) 41(0.6,3.1) 42(0.2,3.1) 43(-0.2,3.1) 44(-0.6,3.1) 45(-1,3.1) 46(-1.4,3.1) 47(-1.8,3.1) 48(-2.2,3.1)
  rect 4.2x4.2 smd: 49(0,0)
R0603
  rect 0.806x0.864 smd: 1(-0.753,0) 2(0.753,0)
SOD-123F_L2.7-W1.6-LS3.8-RD
  rect 1.1x1 smd: 1(-1.735,0) 2(1.735,0)
SOP-16_L10.0-W3.9-P1.27-LS6.0-BL
  oval 0.56x1.745 smd: 1(-4.445,-2.873) 2(-3.175,-2.873) 3(-1.905,-2.873) 4(-0.635,-2.873) 5(0.635,-2.873) 6(1.905,-2.873) 7(3.175,-2.873) 8(4.445,-2.873) 9(4.445,2.873) 10(3.175,2.873) 11(1.905,2.873) 12(0.635,2.873) 13(-0.635,2.873) 14(-1.905,2.873) 15(-3.175,2.873) 16(-4.445,2.873)
SOT-23-3_L2.9-W1.6-P1.90-LS2.8-BR
  rect 1.07x0.6 smd: 1(1.235,-0.95) 2(1.235,0.95) 3(-1.235,0)
USB-A-TH_C46407
  rect 1.524x1.524 hole 0.92: 1(-3.5,1.355)
  round 1.524 hole 0.92: 2(-1,1.355) 3(1,1.355) 4(3.5,1.355)
  round 2.6 hole 2.1: 5(7,-1.355) 6(-7,-1.355)
USB-SMD_TYPE-C16PIN-1
  oval 1.25x2.4 hole 0.65x1.7: 17(-4.325,1.827) 18(4.325,1.827)
  oval 1.4x2.1 hole 0.65x1.4: 19(-4.325,-2.353) 20(4.325,-2.353)
  rect 0.6x1.15 smd: A1B12(-3.2,2.353) A4B9(-2.4,2.353) B1A12(3.2,2.353) B4A9(2.4,2.353)
  rect 0.3x1.15 smd: A5(-1.25,2.353) A6(-0.25,2.353) A7(0.25,2.353) A8(1.25,2.353) B5(1.75,2.353) B6(0.75,2.353) B7(-0.75,2.353) B8(-1.75,2.353)
WQFN-40_L6.0-W4.0-P0.40-TL-EP4.7
  rect 0.8x0.2 smd: 1(-3,1.4) 2(-3,1) 3(-3,0.6) 4(-3,0.2) 5(-3,-0.201) 6(-3,-0.6) 7(-3,-1) 8(-3,-1.4) 21(3,-1.399) 22(3,-1) 23(3,-0.6) 24(3,-0.2) 25(3,0.2) 26(3,0.601) 27(3,1) 28(3,1.4)
  rect 0.2x0.8 smd: 9(-2.2,-2) 10(-1.8,-2) 11(-1.4,-2) 12(-1,-2) 13(-0.6,-2) 14(-0.2,-2) 15(0.2,-2) 16(0.6,-2) 17(1,-2) 18(1.4,-2) 19(1.8,-2) 20(2.2,-2) 29(2.2,2) 30(1.8,2) 31(1.4,2) 32(1,2) 33(0.6,2) 34(0.2,2) 35(-0.2,2) 36(-0.6,2) 37(-1,2) 38(-1.4,2) 39(-1.8,2) 40(-2.2,2)
  rect 4.7x2.7 smd: 41(0,0)

## Nets
As in the schematic.

Pads without a net: C29 2; U2 17 18 19 20 A8 B8; U3 1 2 3 4 15; U4 17 18 19 20; U6 1 2 3 4 5 7 8 9 10 11 14 17 18 19 21 22 23 29 30 31 33 34 35 38; U7 2 3 4 5 10 11 12 25 27 28 29 30 31 32 33 36 44 45 47 48; USB3 17 20 21

# Board PCB2
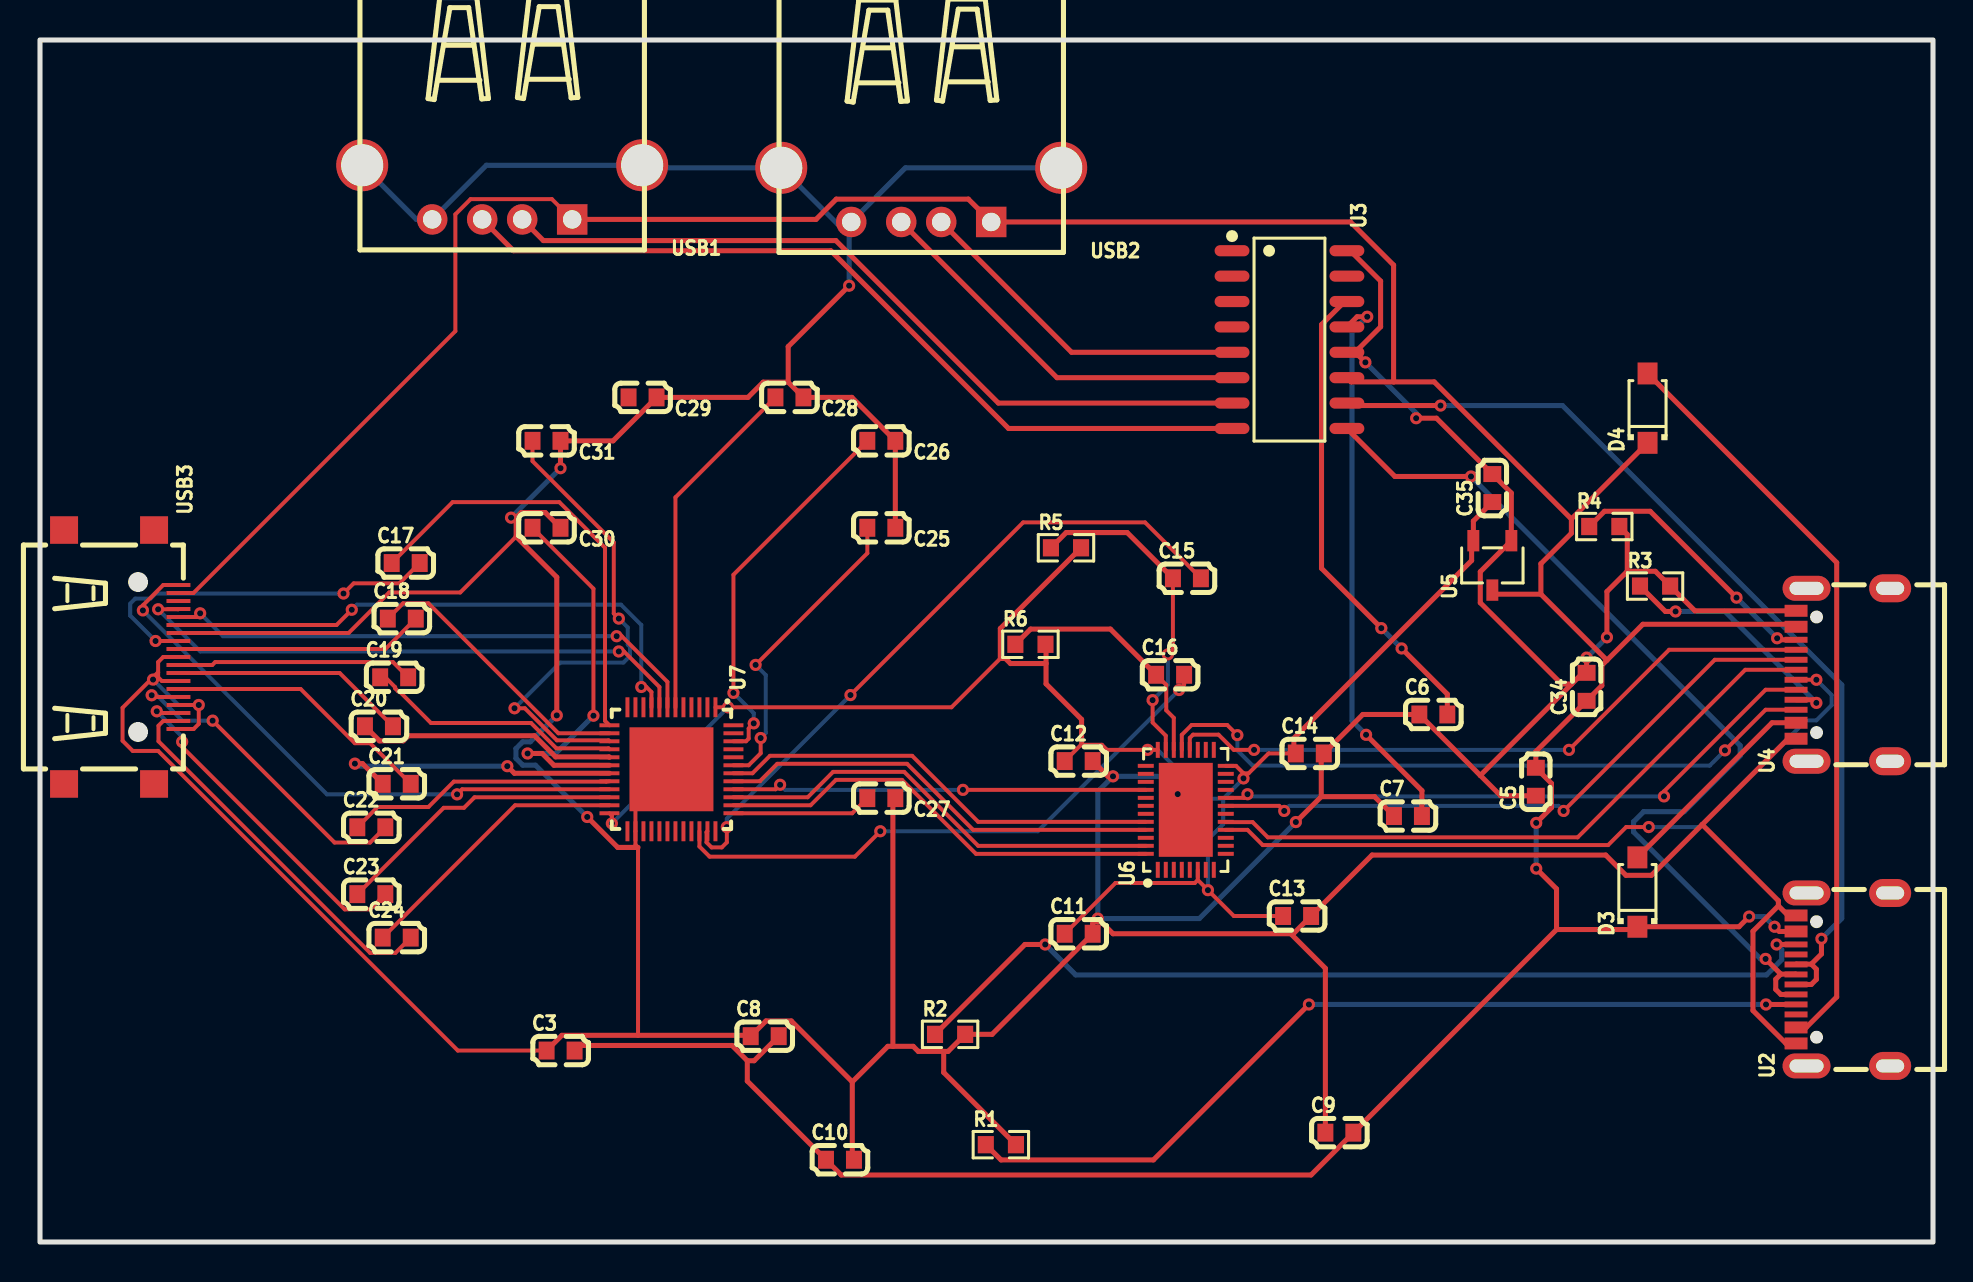
[diagram p4: board, top side]
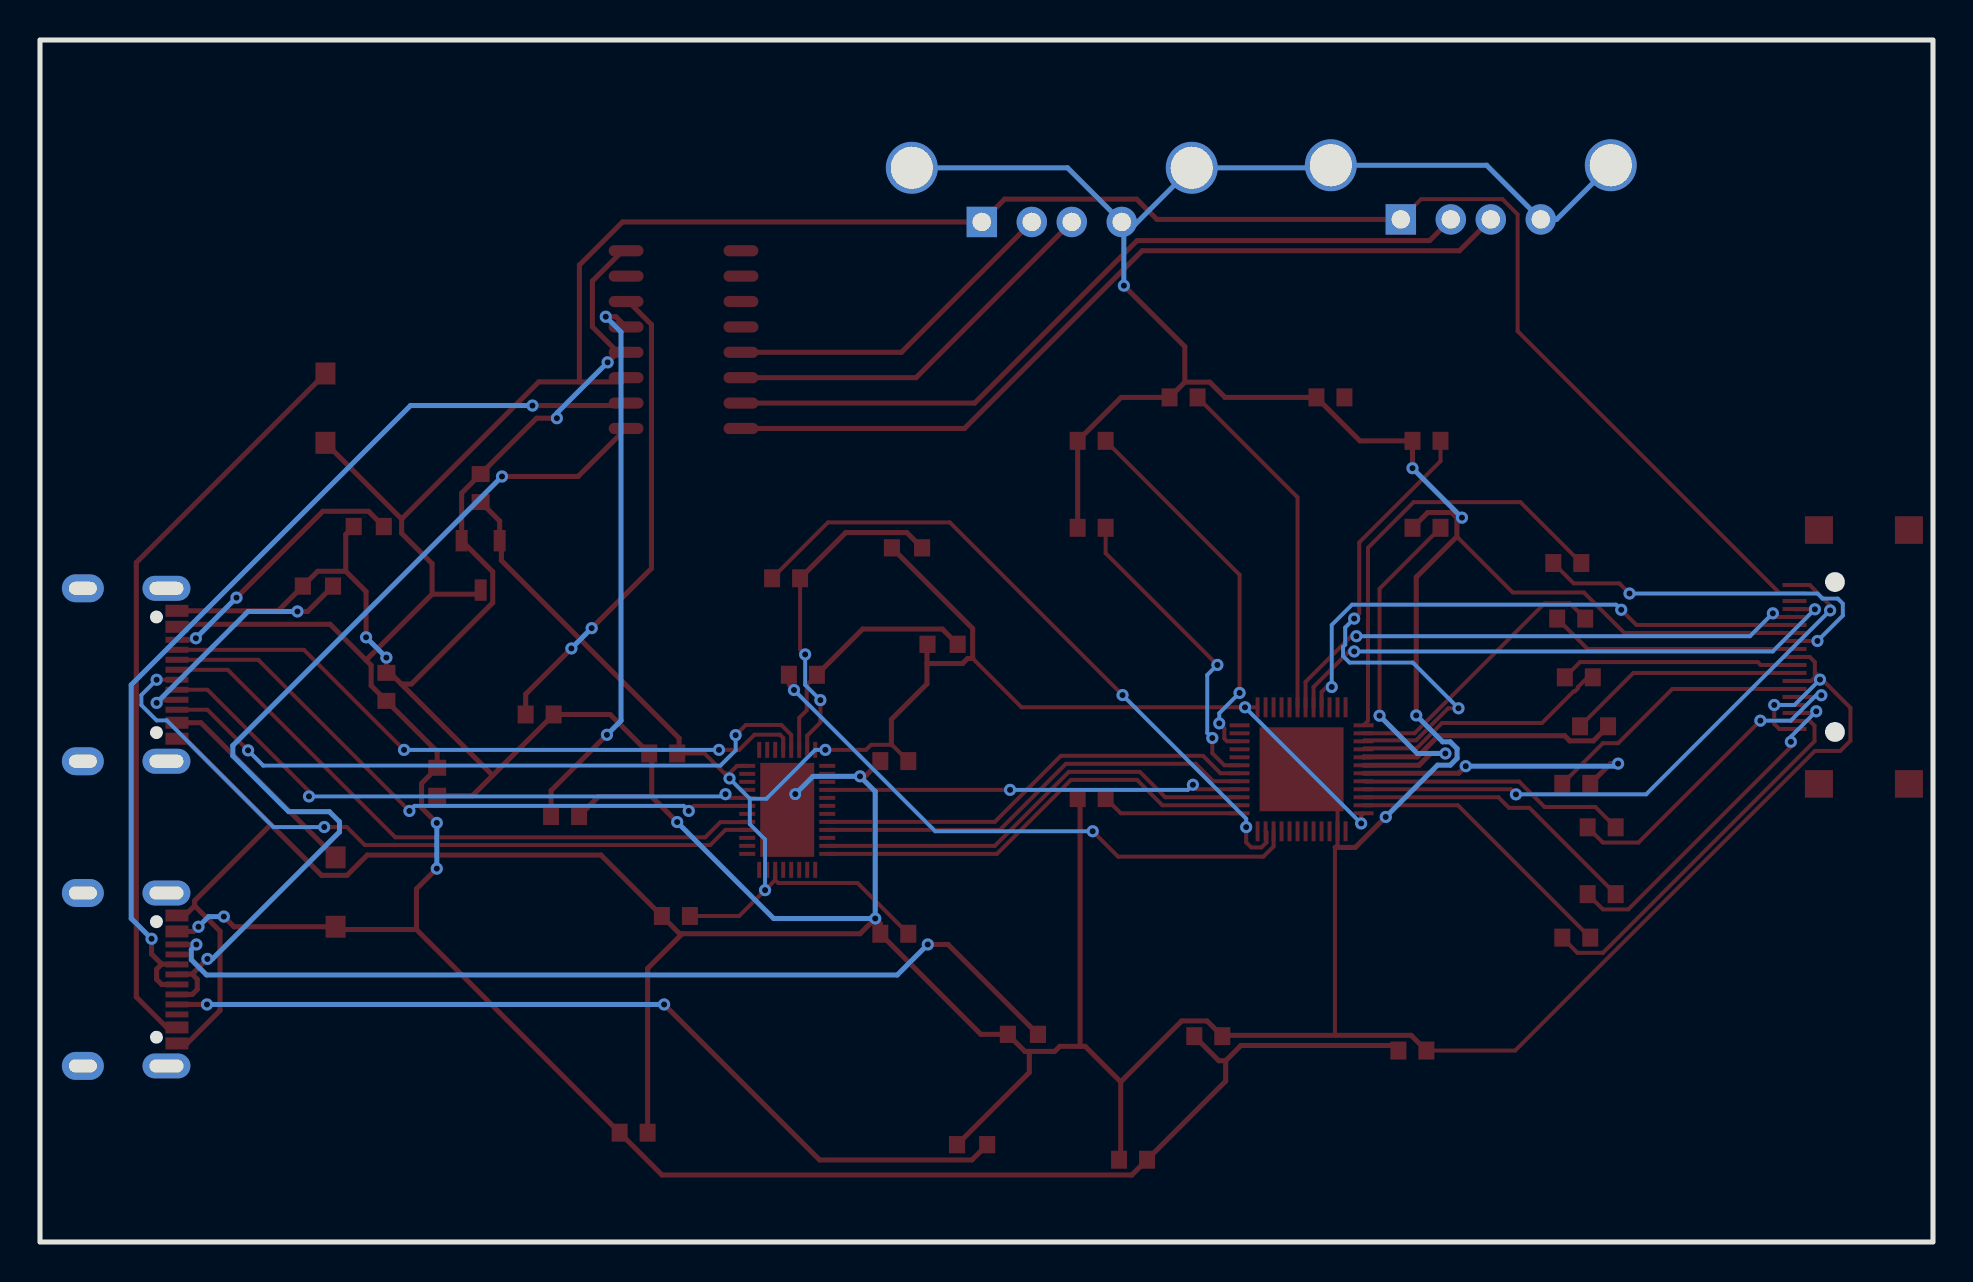
[diagram p5: board, bottom side, seen from below]

Outline 94.67 x 60.12 mm; copper layers: Top Layer, Bottom Layer. Coordinates in mm from the lower left corner of the outline.
Outline path: rectangle 0,60.12 94.67,0
Stack: Top Layer 0.035mm / Dielectric1 1.51mm FR4 er 4.5 / Bottom Layer 0.035mm

## Design rules (mm)
template: JLCPCB Capability(Two Layers Board)
spacing copperThickness1oz (default): track to track 0.102, other pairs 0.152 to 0.3
spacing copperThickness2oz: track to track 0.203, other pairs 0.152 to 0.3
track width copperThickness1oz (default): min 0.127, default 0.254, max 2.54
track width copperThickness2oz: min 0.203, default 0.254, max 2.54
differential pair differentialPair (default): width min 0.127, default 0.254, max 2.54; gap min 0.152, default 0.152
via viaSize (default): diameter min 0.5, default 0.61, max 10; hole min 0.3, default 0.305, max 6.3

## Placement (name value [footprint] x y rotation side)
C3  100nf  [C0603]  26.03 9.58 0 top
C5  100nf  [C0603]  74.8 23.02 90 top
C6  10uf  [C0603]  69.68 26.39 0 top
C7  10uf  [C0603]  68.41 21.31 0 top
C8  100nf  [C0603]  36.24 10.29 0 top
C9  100nf  [C0603]  64.98 5.47 0 top
C10  100nf  [C0603]  40 4.11 0 top
C11  10uf  [C0603]  51.94 15.42 0 top
C12  100nf  [C0603]  51.94 24.05 0 top
C13  100nf  [C0603]  62.86 16.31 0 top
C14  100nf  [C0603]  63.5 24.43 0 top
C15  100nf  [C0603]  57.36 33.2 0 top
C16  100nf  [C0603]  56.51 28.37 0 top
C17  100nf  [C0603]  18.29 33.96 0 top
C18  100nf  [C0603]  18.09 31.18 0 top
C19  100nf  [C0603]  17.71 28.25 0 top
C20  100nf  [C0603]  16.95 25.79 0 top
C21  100nf  [C0603]  17.84 22.92 0 top
C22  100nf  [C0603]  16.57 20.74 0 top
C23  100nf  [C0603]  16.57 17.4 0 top
C24  100nf  [C0603]  17.84 15.22 0 top
C25  10uf  [C0603]  42.07 35.72 180 top
C26  10uf  [C0603]  42.07 40.07 180 top
C27  10uf  [C0603]  42.07 22.2 180 top
C28  10uf  [C0603]  37.48 42.25 180 top
C29  10uf  [C0603]  30.13 42.25 180 top
C30  10uf  [C0603]  25.33 35.72 180 top
C31  10uf  [C0603]  25.33 40.07 180 top
C34  1uf  [C0603]  77.34 27.77 90 top
C35  10uf  [C0603]  72.63 37.71 90 top
D3  1N4148W  [SOD-123F_L2.7-W1.6-LS3.8-RD]  79.88 17.5 90 top
D4  1N4148W  [SOD-123F_L2.7-W1.6-LS3.8-RD]  80.39 41.71 90 top
R1  5.1k  [R0603]  48.05 4.87 0 top
R2  5.1k  [R0603]  45.51 10.39 0 top
R3  5.1k  [R0603]  80.77 32.81 0 top
R4  5.1k  [R0603]  78.23 35.79 0 top
R5  2M  [R0603]  51.31 34.72 0 top
R6  2M  [R0603]  49.53 29.9 0 top
U2  USB_C_Receptacle_HRO_TYPE-C-31-M-12  [USB-SMD_TYPE-C16PIN-1]  90.17 13.13 90 top
U3  SL2.1A  [SOP-16_L10.0-W3.9-P1.27-LS6.0-BL]  62.48 45.14 270 top
U4  USB_C_Receptacle_HRO_TYPE-C-31-M-12  [USB-SMD_TYPE-C16PIN-1]  90.17 28.37 90 top
U5  XC6206P332MR-G  [SOT-23-3_L2.9-W1.6-P1.90-LS2.8-BR]  72.63 33.84 90 top
U6  TUSB1064IRNQR  [WQFN-40_L6.0-W4.0-P0.40-TL-EP4.7]  57.3 21.62 90 top
U7  PS176  [QFN-48_L6.0-W6.0-P0.40-TL-EP3.8]  31.58 23.64 270 top
USB1  903-131A1011D10100  [USB-A-TH_C46407]  23.11 52.5 180 top
USB2  903-131A1011D10100  [USB-A-TH_C46407]  44.07 52.37 180 top
USB3  KH-HDMI-0002  [HDMI-SMD_KH-HDMI-0002]  4.06 29.26 270 top

## Footprints (pads in the part's own frame, mm; a bottom-side part is the same pattern mirrored in y, then rotated)
C0603
  rect 0.8x0.9 smd: 1(-0.7,0) 2(0.7,0)
HDMI-SMD_KH-HDMI-0002
  rect 0.2x1.2 smd: 1(3.6,2.86) 2(3.2,2.86) 3(2.8,2.86) 4(2.4,2.86) 5(2,2.86) 6(1.6,2.86) 7(1.2,2.86) 8(0.8,2.86) 9(0.4,2.86) 10(0,2.86) 11(-0.4,2.86) 12(-0.8,2.86) 13(-1.2,2.86) 14(-1.6,2.86) 15(-2,2.86) 16(-2.4,2.86) 17(-2.8,2.86) 18(-3.2,2.86) 19(-3.6,2.86)
  rect 1.38x1.4 smd: 20(-6.35,1.64) 20(6.35,1.64) 21(-6.35,-2.86) 21(6.35,-2.86)
QFN-48_L6.0-W6.0-P0.40-TL-EP3.8
  rect 1x0.2 smd: 1(-3.1,2.2) 2(-3.1,1.8) 3(-3.1,1.4) 4(-3.1,1) 5(-3.1,0.6) 6(-3.1,0.2) 7(-3.1,-0.2) 8(-3.1,-0.6) 9(-3.1,-1) 10(-3.1,-1.4) 11(-3.1,-1.8) 12(-3.1,-2.2) 25(3.1,-2.2) 26(3.1,-1.8) 27(3.1,-1.4) 28(3.1,-1) 29(3.1,-0.6) 30(3.1,-0.2) 31(3.1,0.2) 32(3.1,0.6) 33(3.1,1) 34(3.1,1.4) 35(3.1,1.8) 36(3.1,2.2)
  rect 0.2x1 smd: 13(-2.2,-3.1) 14(-1.8,-3.1) 15(-1.4,-3.1) 16(-1,-3.1) 17(-0.6,-3.1) 18(-0.2,-3.1) 19(0.2,-3.1) 20(0.6,-3.1) 21(1,-3.1) 22(1.4,-3.1) 23(1.8,-3.1) 24(2.2,-3.1) 37(2.2,3.1) 38(1.8,3.1) 39(1.4,3.1) 40(1,3.1) 41(0.6,3.1) 42(0.2,3.1) 43(-0.2,3.1) 44(-0.6,3.1) 45(-1,3.1) 46(-1.4,3.1) 47(-1.8,3.1) 48(-2.2,3.1)
  rect 4.2x4.2 smd: 49(0,0)
R0603
  rect 0.806x0.864 smd: 1(-0.753,0) 2(0.753,0)
SOD-123F_L2.7-W1.6-LS3.8-RD
  rect 1.1x1 smd: 1(-1.735,0) 2(1.735,0)
SOP-16_L10.0-W3.9-P1.27-LS6.0-BL
  oval 0.56x1.745 smd: 1(-4.445,-2.873) 2(-3.175,-2.873) 3(-1.905,-2.873) 4(-0.635,-2.873) 5(0.635,-2.873) 6(1.905,-2.873) 7(3.175,-2.873) 8(4.445,-2.873) 9(4.445,2.873) 10(3.175,2.873) 11(1.905,2.873) 12(0.635,2.873) 13(-0.635,2.873) 14(-1.905,2.873) 15(-3.175,2.873) 16(-4.445,2.873)
SOT-23-3_L2.9-W1.6-P1.90-LS2.8-BR
  rect 1.07x0.6 smd: 1(1.235,-0.95) 2(1.235,0.95) 3(-1.235,0)
USB-A-TH_C46407
  rect 1.524x1.524 hole 0.92: 1(-3.5,1.355)
  round 1.524 hole 0.92: 2(-1,1.355) 3(1,1.355) 4(3.5,1.355)
  round 2.6 hole 2.1: 5(7,-1.355) 6(-7,-1.355)
USB-SMD_TYPE-C16PIN-1
  oval 1.25x2.4 hole 0.65x1.7: 17(-4.325,1.827) 18(4.325,1.827)
  oval 1.4x2.1 hole 0.65x1.4: 19(-4.325,-2.353) 20(4.325,-2.353)
  rect 0.6x1.15 smd: A1B12(-3.2,2.353) A4B9(-2.4,2.353) B1A12(3.2,2.353) B4A9(2.4,2.353)
  rect 0.3x1.15 smd: A5(-1.25,2.353) A6(-0.25,2.353) A7(0.25,2.353) A8(1.25,2.353) B5(1.75,2.353) B6(0.75,2.353) B7(-0.75,2.353) B8(-1.75,2.353)
WQFN-40_L6.0-W4.0-P0.40-TL-EP4.7
  rect 0.8x0.2 smd: 1(-3,1.4) 2(-3,1) 3(-3,0.6) 4(-3,0.2) 5(-3,-0.201) 6(-3,-0.6) 7(-3,-1) 8(-3,-1.4) 21(3,-1.399) 22(3,-1) 23(3,-0.6) 24(3,-0.2) 25(3,0.2) 26(3,0.601) 27(3,1) 28(3,1.4)
  rect 0.2x0.8 smd: 9(-2.2,-2) 10(-1.8,-2) 11(-1.4,-2) 12(-1,-2) 13(-0.6,-2) 14(-0.2,-2) 15(0.2,-2) 16(0.6,-2) 17(1,-2) 18(1.4,-2) 19(1.8,-2) 20(2.2,-2) 29(2.2,2) 30(1.8,2) 31(1.4,2) 32(1,2) 33(0.6,2) 34(0.2,2) 35(-0.2,2) 36(-0.6,2) 37(-1,2) 38(-1.4,2) 39(-1.8,2) 40(-2.2,2)
  rect 4.7x2.7 smd: 41(0,0)

## Nets
As in the schematic.

Pads without a net: C29 2; U2 17 18 19 20 A8 B8; U3 1 2 3 4 15; U4 17 18 19 20; U6 1 2 3 4 5 7 8 9 10 11 14 17 18 19 21 22 23 29 30 31 33 34 35 38; U7 2 3 4 5 10 11 12 25 27 28 29 30 31 32 33 36 44 45 47 48; USB3 17 20 21

## Via types
v1: diameter 0.61, hole 0.305, Top Layer to Bottom Layer, 82 vias

## Routing (per net, layer and track width the routed paths; a pad name or vN(x,y) marks a point on that pad's centre or on a via; arc(x,y) is an arc through that point)
3V3: length 89.9
  Top Layer w0.2: 60.18,23.44 60.44,23.44 61.43,24.43 C14.1 ; 60.18,23.44 59.81,23.82 U6.20 ; 60.18,23.44 v1(60.18,23.19) ; 57.9,18.11 57.75,17.96 53.78,17.96 C11.1 ; 57.9,18.11 v1(58.41,17.6) 59.7,16.31 C13.1 ; 57.9,18.11 U6.6 ; v1(28.6,20.94) 28.6,21.32 U7.24 ; 48.02,29.19 45.58,26.74 v1(34.41,26.74) U7.1 ; U6.28 v1(55.39,24.62) 53.36,24.62 53.1,24.87 52.06,24.87 C12.1
  Top Layer w0.254: R6.2 50.31,29.87 50.31,28.93 ; 52.09,24.87 52.09,26.14 50.31,27.92 50.31,28.93 ; 50.31,28.93 48.53,28.93 48.28,29.19 48.02,29.19 48.02,30.69 R5.2 ; 62.7,24.43 62.7,25.2 71.59,34.09 71.59,34.99 U5.2 71.68,36.06 C35.1
  Bottom Layer w0.2: v1(55.39,24.62) U6.28 58.34,22.17 59.17,22.17 ; 59.17,22.17 v1(60.18,23.19) ; 59.17,22.17 59.17,20.9 58.41,20.14 v1(58.41,17.6) ; v1(34.41,26.74) v1(28.6,20.94)
+5V: length 210
  Top Layer w0.2: USB1.1 25.6,52.16 21.53,52.16 20.77,51.4 20.77,45.56 7.67,32.46 USB3.18
  Top Layer w0.254: C8.2 35.71,9.07 35.37,9.07 ; U4.B4A9 87.69,30.9 80.16,30.9 78.36,29.1 ; U5.3 72.83,32.4 75.06,32.4 ; 76.58,36.16 69.72,43.02 67.69,43.02 ; 76.58,36.16 D4.1 ; 76.58,36.16 76.58,35.45 75.06,33.93 75.06,32.4 ; 78.36,29.1 75.06,32.4 ; 78.36,29.1 78.11,28.85 78.11,27.83 C34.1 74.8,24.53 C5.2 75.58,22.94 75.58,21.72 v1(74.82,20.96) ; C3.2 26.99,9.83 34.61,9.83 35.37,9.07 ; 35.37,9.07 35.37,8.05 C10.1 40.07,3.35 63.56,3.35 C9.2 75.84,15.63 ; v1(74.82,18.68) 75.84,17.66 75.84,15.63 ; 67.69,43.02 65.57,43.02 U3.11 ; 67.69,43.02 67.69,48.86 65.53,51.02 USB2.1 46.43,52.16 39.82,52.16 38.81,51.15 USB1.1 ; v1(86.74,15.77) 86.98,15.53 U2.B4A9 ; 75.84,15.63 79.74,15.63 D3.1 84.96,15.77 v1(85.47,16.28)
  Bottom Layer w0.254: v1(86.74,15.77) 86.23,16.28 v1(85.47,16.28) ; v1(74.82,18.68) v1(74.82,20.96)
GND: length 399.2
  Top Layer w0.2: 5.65,28.24 v1(5.65,28.13) ; 5.65,28.24 5.91,28.5 ; 5.65,28.24 4.13,26.72 4.13,25.07 4.64,24.56 5.91,24.56 20.89,9.58 C3.1 ; 5.91,28.5 5.91,28.24 6.09,28.06 USB3.7 ; 5.91,28.5 5.91,29.01 6.16,29.26 USB3.10 ; USB3.1 7.69,25.66 7.94,25.91 v1(7.94,26.86) USB3.4 ; U7.49 29.78,21.84 U7.26 29.78,19.86 29.91,19.74 29.91,10.34 ; 23.81,35.28 21.02,32.49 17.46,32.49 15.43,30.46 USB3.13
  Top Layer w0.254: 86.93,16.81 87.42,16.33 U2.B1A12 ; 86.93,16.81 85.66,15.54 85.66,11.58 87.31,9.93 U2.A1B12 ; 86.93,16.81 86.93,17.07 83.12,20.88 ; v1(26.03,38.7) C31.1 28.66,40.07 C29.1 35.41,42.25 36.17,43.01 37.42,43.01 ; v1(40.46,47.83) 37.42,44.79 37.42,43.01 ; 76.6,27.91 77.16,28.47 C34.2 v1(77.34,29.23) ; 76.6,27.91 76.09,27.91 72.03,31.97 72.03,33.52 U5.1 73.58,37.46 C35.2 69.83,41.2 v1(68.82,41.2) ; 76.6,27.91 72.03,23.34 ; 83.12,20.88 87.42,25.17 U4.A1B12 ; 83.12,20.88 80.58,18.34 79.31,18.34 78.3,19.35 66.61,19.35 C13.2 62.68,15.42 62.55,15.42 ; 72.03,23.34 73.04,22.32 C5.1 ; 72.03,23.34 C6.1 66.15,26.39 64.07,24.31 64.07,22.28 ; 64.07,22.28 66.74,22.28 C7.1 ; 64.07,22.28 v1(62.8,21.01) ; 37.42,43.01 C28.1 40.6,42.25 C26.1 C25.1 ; 23.81,36.23 23.81,35.28 25.84,33.25 v1(25.84,26.34) ; 23.81,36.23 24.06,36.49 25.27,36.49 C30.1 ; 23.81,36.23 v1(23.56,36.23) ; R1.2 45.19,8.48 45.19,9.53 ; C9.1 64.28,13.69 62.55,15.42 ; 79.38,33.55 79.38,35.39 R4.2 ; 79.38,33.55 80.78,33.55 R3.2 82.76,31.57 U4.B1A12 ; 79.38,33.55 78.36,32.53 v1(78.36,30.25) ; 40.62,8.01 42.4,9.79 42.65,9.79 ; 40.62,8.01 40.62,4.2 C10.2 ; 40.62,8.01 37.57,11.06 36.3,11.06 C8.1 35.5,10.34 26.1,10.34 C3.1 ; v1(66.28,44) 65.77,44.51 ; 65.77,44.51 65.36,44.51 ; 65.77,44.51 67.04,45.78 67.04,48.06 65.52,49.58 U3.16 ; 42.65,9.79 43.67,9.79 43.92,9.53 45.19,9.53 ; 42.65,9.79 42.65,22.08 C27.1 ; 62.55,15.42 53.66,15.42 v1(52.9,16.18) 52.64,15.93 C11.2 47.61,10.39 R2.2 45.41,9.53 45.19,9.53 ; v1(56.9,22.4) 57.3,22 U6.41 ; v1(53.66,23.29) 53.4,23.29 C12.2 ; 29.91,19.74 28.89,19.74 v1(27.37,21.26)
  Bottom Layer w0.2: v1(5.65,28.13) USB3.4 v1(7.94,26.86)
  Bottom Layer w0.254: v1(27.37,21.26) 24.78,23.85 24.14,23.85 23.8,24.19 23.8,24.68 24.14,25.02 24.52,25.02 v1(25.84,26.34) ; v1(56.9,22.4) 56.01,23.29 v1(53.66,23.29) 52.9,22.53 v1(52.9,16.18) 57.98,16.18 v1(62.8,21.01) ; USB2.6 43.28,53.73 USB2.4 40.46,50.88 ; v1(77.34,29.23) v1(78.36,30.25) ; v1(68.82,41.2) 68.82,41.46 v1(66.28,44) ; 40.46,50.88 39.92,50.88 USB2.5 30.24,53.73 USB1.6 22.32,53.86 USB1.4 18.82,51.15 USB1.5 ; 40.46,50.88 v1(40.46,47.83) ; v1(23.56,36.23) v1(26.03,38.7)
AUXN_PS176: length 29.3
  Top Layer w0.2: v1(56.96,27.61) 57.21,27.86 C16.2 ; U7.34 32.98,19.78 33.48,19.27 40.75,19.27 v1(42.02,20.54)
  Bottom Layer w0.2: v1(42.02,20.54) 49.9,20.54 v1(56.96,27.61)
AUXN_TUSB: length 16.6
  Top Layer w0.2: v1(56.4,29.39) 56.66,29.64 C15.1 ; U6.27 56.3,25.32 55.64,25.98 v1(55.64,27.1)
  Top Layer w0.254: R5.1 51.32,35.48 54.37,35.48 C15.1
  Bottom Layer w0.2: v1(55.64,27.1) 56.4,27.86 v1(56.4,29.39)
AUXP_PS176: length 34
  Top Layer w0.2: v1(40.53,27.36) 49.17,35.99 55.26,35.99 58.06,33.2 ; v1(34.35,20.75) 34.35,19.99 34.09,19.74 33.58,19.74 33.33,19.99 33.33,20.5 U7.35
  Bottom Layer w0.2: v1(34.35,20.75) 34.35,21.17 v1(40.53,27.36)
AUXP_TUSB: length 12.4
  Top Layer w0.2: C16.1 56.32,27.86 56.32,26.59 56.7,26.22 U6.26
  Top Layer w0.254: C16.1 53.53,30.66 49.54,30.66 R6.1
D+1: length 36.1
  Top Layer w0.2: U6.12 60.39,20.61 61.15,19.85 78.42,19.85 79.32,20.76 v1(80.45,20.76) ; U4.A6 v1(88.83,28.12)
  Bottom Layer w0.2: v1(88.83,28.12) 89.6,27.36 89.6,26.85 88.83,26.09 88.33,26.09 82.99,20.76 v1(80.45,20.76)
D+2: length 32
  Top Layer w0.2: v1(62.22,21.56) 61.97,21.81 U6.15 ; v1(76.19,21.56) 83.75,29.12 U4.B6
  Bottom Layer w0.2: v1(76.19,21.56) 75.94,21.81 62.48,21.81 v1(62.22,21.56)
D-1: length 32.3
  Top Layer w0.2: U4.A7 85.28,28.62 76.89,20.24 61.4,20.24 60.64,21 59.31,21 U6.13
D-2: length 31
  Top Layer w0.2: U4.B7 86.29,27.62 81.21,22.54 v1(81.21,22.29) ; U6.16 60.2,22.21 v1(60.39,22.4)
  Bottom Layer w0.2: v1(81.21,22.29) 60.5,22.29 v1(60.39,22.4)
DM1: length 39.3
  Top Layer w0.254: U3.7 47.93,41.96 39.8,50.09 25.17,50.09 USB1.2
DM2: length 17.2
  Top Layer w0.254: U3.5 51.59,44.5 USB2.2
DN: length 47
  Top Layer w0.254: 87.05,13.4 87.8,13.4 U2.A7 ; 87.05,13.4 v1(86.29,14.16) ; 87.05,13.4 86.8,13.14 86.8,12.64 87.05,12.38 U2.B7 ; v1(71.56,38.29) 67.76,38.29 U3.9
  Bottom Layer w0.254: v1(86.29,14.16) 86.04,14.16 79.69,20.51 79.69,21.02 80.2,21.53 82.23,21.53 85.02,24.32 85.02,24.83 v1(71.56,38.29)
DP: length 47.9
  Top Layer w0.254: 88.58,13.9 89.09,14.41 v1(89.09,15.17) ; 88.58,13.9 88.83,13.64 88.83,13.14 88.58,12.88 U2.A6 ; 88.58,13.9 87.83,13.9 U2.B6 ; U3.10 65.48,41.84 v1(70.04,41.84)
  Bottom Layer w0.254: v1(89.09,15.17) 90.1,16.18 90.1,27.87 76.13,41.84 v1(70.04,41.84)
DP0N: length 22.7
  Top Layer w0.2: U6.39 46.92,19.82 43.22,23.51 39.66,23.51 38.39,22.24 U7.39
DP0P: length 22.7
  Top Layer w0.2: U6.40 46.81,19.41 43.11,23.11 39.8,23.11 38.53,21.84 U7.38
DP1: length 41.8
  Top Layer w0.254: U3.8 48.44,40.69 39.55,49.58 23.68,49.58 USB1.3
DP1N: length 22.4
  Top Layer w0.2: U6.36 46.92,21.02 43.61,24.32 36.5,24.32 35.63,23.44 U7.42
DP1P: length 22.4
  Top Layer w0.2: U7.41 35.99,23.04 36.87,23.92 43.36,23.92 46.66,20.62 U6.37
DP2: length 19.8
  Top Layer w0.254: U3.6 50.86,43.23 USB2.3
DP_HPD: length 20.8
  Top Layer w0.2: U7.40 36.79,22.64 v1(37.01,22.87) ; U6.32 v1(46.15,22.62)
  Bottom Layer w0.2: v1(46.15,22.62) 37.26,22.62 v1(37.01,22.87)
HDMI_HPD: length 29.7
  Top Layer w0.2: U7.21 21.11,22.64 v1(20.86,22.39) ; v1(5.15,31.59) 5.15,31.84 6.16,32.86 USB3.19
  Bottom Layer w0.2: v1(5.15,31.59) 14.35,22.39 v1(20.86,22.39)
HDMICEC: length 28.5
  Top Layer w0.2: USB3.14 14.83,30.86 v1(15.59,31.62) ; v1(30.07,27.76) 30.32,27.76 30.58,27.51 U7.9
  Bottom Layer w0.2: v1(30.07,27.76) 30.07,30.86 29.05,31.88 15.84,31.88 v1(15.59,31.62)
HDMICKN: length 21.8
  Top Layer w0.2: U7.13 28.26,26.07 28.26,34.72 25.97,37.01 20.64,37.01 C17.1
HDMICKP: length 14.1
  Top Layer w0.2: U7.14 25.92,25.44 19.42,31.94 18.16,31.94 C18.1
HDMID0N: length 13
  Top Layer w0.2: U7.16 28.43,24.69 25.82,24.69 24.56,25.96 19.55,25.96 17.97,27.54 17.91,27.54 17.76,27.69 17.76,27.75 17.27,28.25 C19.1
HDMID0P: length 13.1
  Top Layer w0.254: U7.17 28.46,24.27 25.78,24.27 24.73,25.32 18.42,25.32 18.17,25.07 16.98,25.07 C20.1
HDMID1N: length 14.7
  Top Layer w0.254: U7.19 23.72,23.44 v1(23.37,23.8) ; C21.1 16.13,23.93 v1(15.75,23.93)
  Bottom Layer w0.254: v1(23.37,23.8) 15.87,23.8 v1(15.75,23.93)
HDMID1P: length 13.6
  Top Layer w0.2: C22.1 16.89,21.76 19.42,21.76 20.7,23.03 28.32,23.03 U7.20
HDMIDN2: length 14.6
  Top Layer w0.2: U7.22 21.73,22.24 21.2,21.72 20.19,21.72 C23.1
HDMIDP2: length 14.1
  Top Layer w0.2: C24.1 23.76,21.84 U7.23
SBU1: length 33.4
  Top Layer w0.2: U6.24 57.5,25.21 57.66,25.38 58.93,25.38 59.7,24.62 v1(60.71,24.62) ; v1(76.46,24.62) 81.47,29.62 U4.A8
  Bottom Layer w0.2: v1(76.46,24.62) v1(60.71,24.62)
SBU2: length 34.1
  Top Layer w0.2: U6.25 57.1,25.37 57.59,25.86 59.37,25.86 v1(59.88,25.35) ; U4.B8 86.29,26.62 v1(84.26,24.59)
  Bottom Layer w0.2: v1(84.26,24.59) 83.5,23.83 60.64,23.83 59.88,24.59 v1(59.88,25.35)
SCL: length 27.2
  Top Layer w0.2: v1(8.01,31.45) 7.83,31.26 USB3.15 ; v1(28.84,30.3) 29.09,30.3 31.38,28.01 U7.7
  Bottom Layer w0.2: v1(28.84,30.3) 9.15,30.3 v1(8.01,31.45)
SDA: length 28.7
  Top Layer w0.2: v1(28.95,29.54) 29.2,29.54 30.98,27.76 U7.8 ; v1(5.91,31.65) 6.91,31.65 USB3.16
  Bottom Layer w0.2: v1(28.95,29.54) 8.02,29.54 v1(5.91,31.65)
TMDS2N: length 17.3
  Top Layer w0.2: v1(5.84,26.54) 5.92,26.46 USB3.3 ; v1(7.11,25.02) 7.11,24.77 15.24,16.64 16.51,16.64 C23.2
  Bottom Layer w0.2: v1(7.11,25.02) 7.11,25.27 v1(5.84,26.54)
TMDSCKN: length 18.9
  Top Layer w0.2: v1(15.18,32.44) 15.69,32.94 17.97,32.94 C17.2 ; v1(5.78,30.06) USB3.12
  Bottom Layer w0.2: v1(15.18,32.44) 5.78,32.44 5.53,32.18 4.76,32.18 4.51,31.93 4.51,31.33 v1(5.78,30.06)
TMDSCKP: length 12.5
  Top Layer w0.2: USB3.11 17.27,29.66 C18.2
TMDSD0N: length 11.9
  Top Layer w0.2: C19.2 17.65,29.01 8.76,29.01 8.61,28.86 USB3.9
TMDSD0P: length 11.8
  Top Layer w0.2: C20.2 14.98,28.46 USB3.8
TMDSD1N: length 13.6
  Top Layer w0.2: C21.2 16.51,24.95 15.75,24.95 13.03,27.66 USB3.6
TMDSD1P: length 16.4
  Top Layer w0.2: USB3.5 5.67,27.26 v1(5.59,27.35) ; v1(8.63,26.08) 14.73,19.98 16.51,19.98 C22.2
  Bottom Layer w0.2: v1(5.59,27.35) 5.84,27.35 7.11,26.08 v1(8.63,26.08)
TMDSD2P: length 19.2
  Top Layer w0.2: C24.2 17.78,14.46 16.51,14.46 5.93,25.04 5.93,25.82 6.16,26.06 USB3.2
$1N12287: length 44.1
  Top Layer w0.254: R1.1 48.06,4.11 55.68,4.11 v1(63.46,11.88) ; v1(86.32,11.88) U2.A5
  Bottom Layer w0.254: v1(63.46,11.88) v1(86.32,11.88)
$1N12289: length 47
  Top Layer w0.254: v1(50.27,14.88) 49.25,14.88 R2.1 ; v1(86.85,14.88) U2.B5
  Bottom Layer w0.254: v1(50.27,14.88) 51.79,13.36 86.34,13.36 87.1,14.12 87.1,14.63 v1(86.85,14.88)
$1N12299: length 12.3
  Top Layer w0.254: v1(88.83,26.97) 88.68,27.12 U4.A5 ; v1(81.79,31.54) 81.28,31.54 R3.1
  Bottom Layer w0.254: v1(81.79,31.54) 84.26,31.54 v1(88.83,26.97)
$1N12301: length 13.3
  Top Layer w0.254: v1(84.84,32.23) 80.52,36.55 78.23,36.55 R4.1 ; U4.B5 86.95,30.12 v1(86.87,30.2)
  Bottom Layer w0.254: v1(84.84,32.23) v1(86.87,30.2)
$1N12314: length 23.9
  Top Layer w0.254: v1(67.08,30.7) 64.09,33.69 64.09,45.89 65.24,47.04 U3.14 ; v1(68.09,29.69) 70.38,27.4 C6.2
  Bottom Layer w0.254: v1(68.09,29.69) v1(67.08,30.7)
$1N12316: length 28
  Top Layer w0.254: v1(66.31,25.37) 69.11,22.58 C7.2 ; U3.13 65.86,46.28 v1(66.37,46.28)
  Bottom Layer w0.254: v1(66.31,25.37) 65.61,26.07 65.61,45.52 v1(66.37,46.28)
$1N12385: length 37.8
  Top Layer w0.254: D4.2 89.85,33.98 89.85,12.26 88.33,10.73 U2.A4B9
$1N12387: length 10.7
  Top Layer w0.254: U4.A4B9 86.62,25.97 D3.2
$1N12413: length 15.5
  Top Layer w0.2: v1(35.79,28.87) 41.37,34.45 C25.2 ; v1(36.04,25.21) 36.04,24.45 35.44,23.84 U7.43
  Bottom Layer w0.2: v1(35.79,28.87) 36.29,28.36 36.29,25.46 v1(36.04,25.21)
$1N12416: length 19
  Top Layer w0.2: v1(35.69,25.94) 35.44,25.69 35.44,25.18 35.3,25.04 U7.46 ; C26.2 34.68,33.37 v1(34.68,27.46)
  Bottom Layer w0.2: v1(34.68,27.46) 35.69,26.45 v1(35.69,25.94)
$1N12417: length 7
  Top Layer w0.2: C27.2 40.62,21.44 U7.37
$1N12419: length 17.6
  Top Layer w0.2: C28.2 31.78,37.25 U7.6
$1N12422: length 19.1
  Top Layer w0.2: C30.2 27.68,32.68 v1(27.68,26.33)
  Top Layer w0.254: v1(24.38,24.43) 25.11,24.43 25.7,23.84 U7.18
  Bottom Layer w0.254: v1(24.38,24.43) 25.79,24.43 v1(27.68,26.33)
$1N12424: length 25.1
  Top Layer w0.2: U7.15 28.43,25.09 25.85,25.09 24.25,26.7 v1(23.73,26.7) ; C31.2 24.63,39.06 28.69,34.99 28.69,31.44 v1(28.95,31.18)
  Bottom Layer w0.2: v1(28.95,31.18) 29.39,30.73 29.39,29.88 29.5,29.77 29.5,29.31 29.18,28.98 26.02,28.98 v1(23.73,26.7)
